# EAGLE board A20-OLinuXino-Lime-4GB_Rev_D (EAGLE 4.16), part 1 of 5
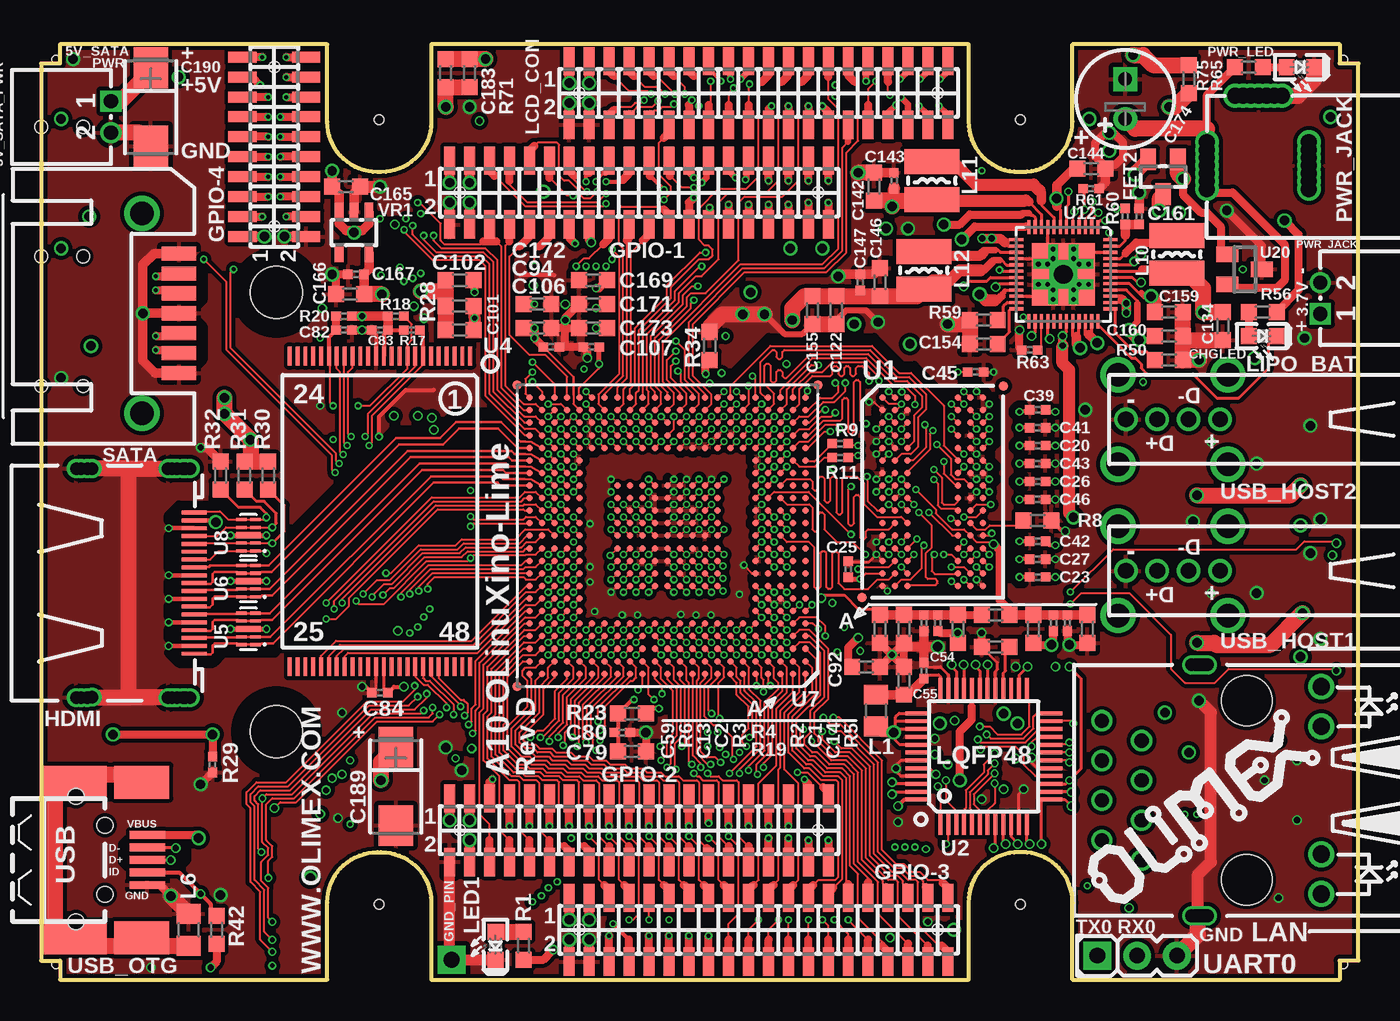
[diagram p5: board, top side]
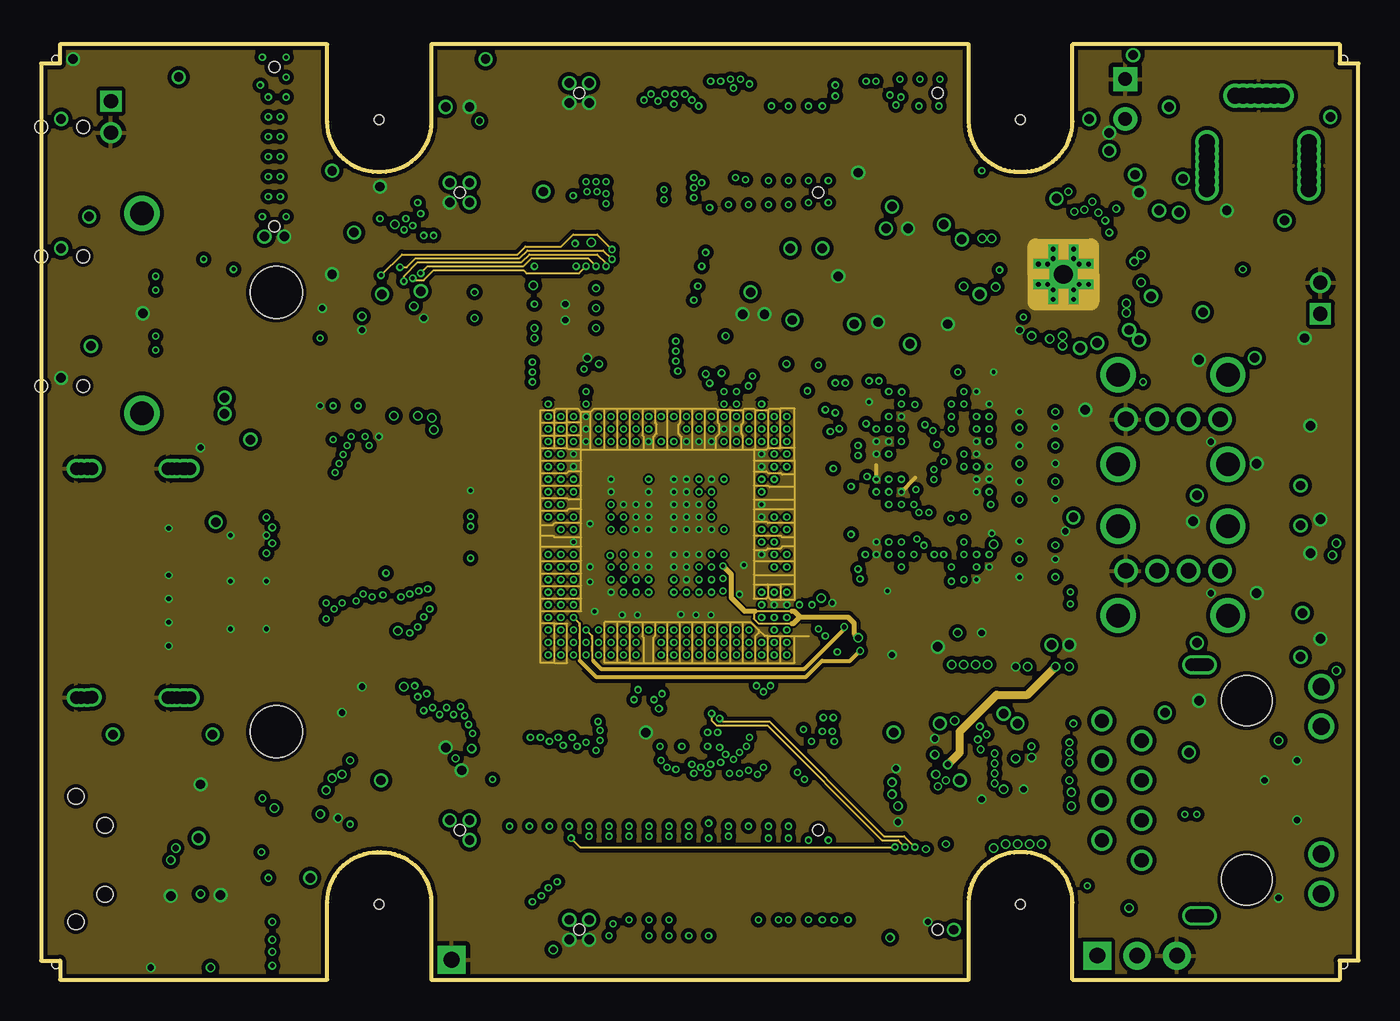
[diagram p6: board, inner layer Route2]
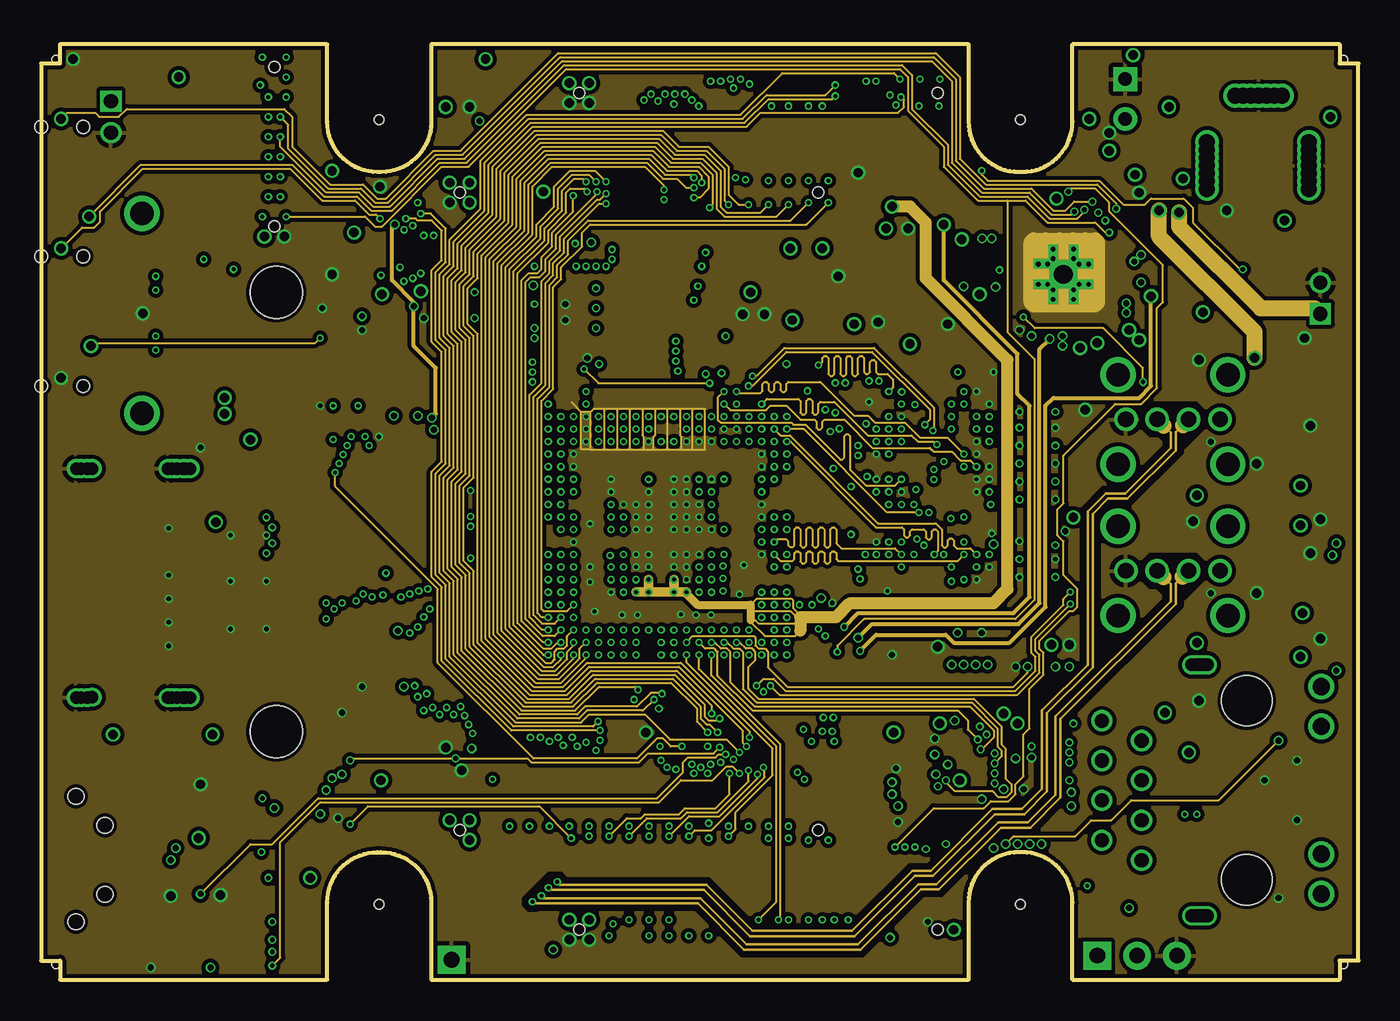
[diagram p7: board, inner layer Route3]
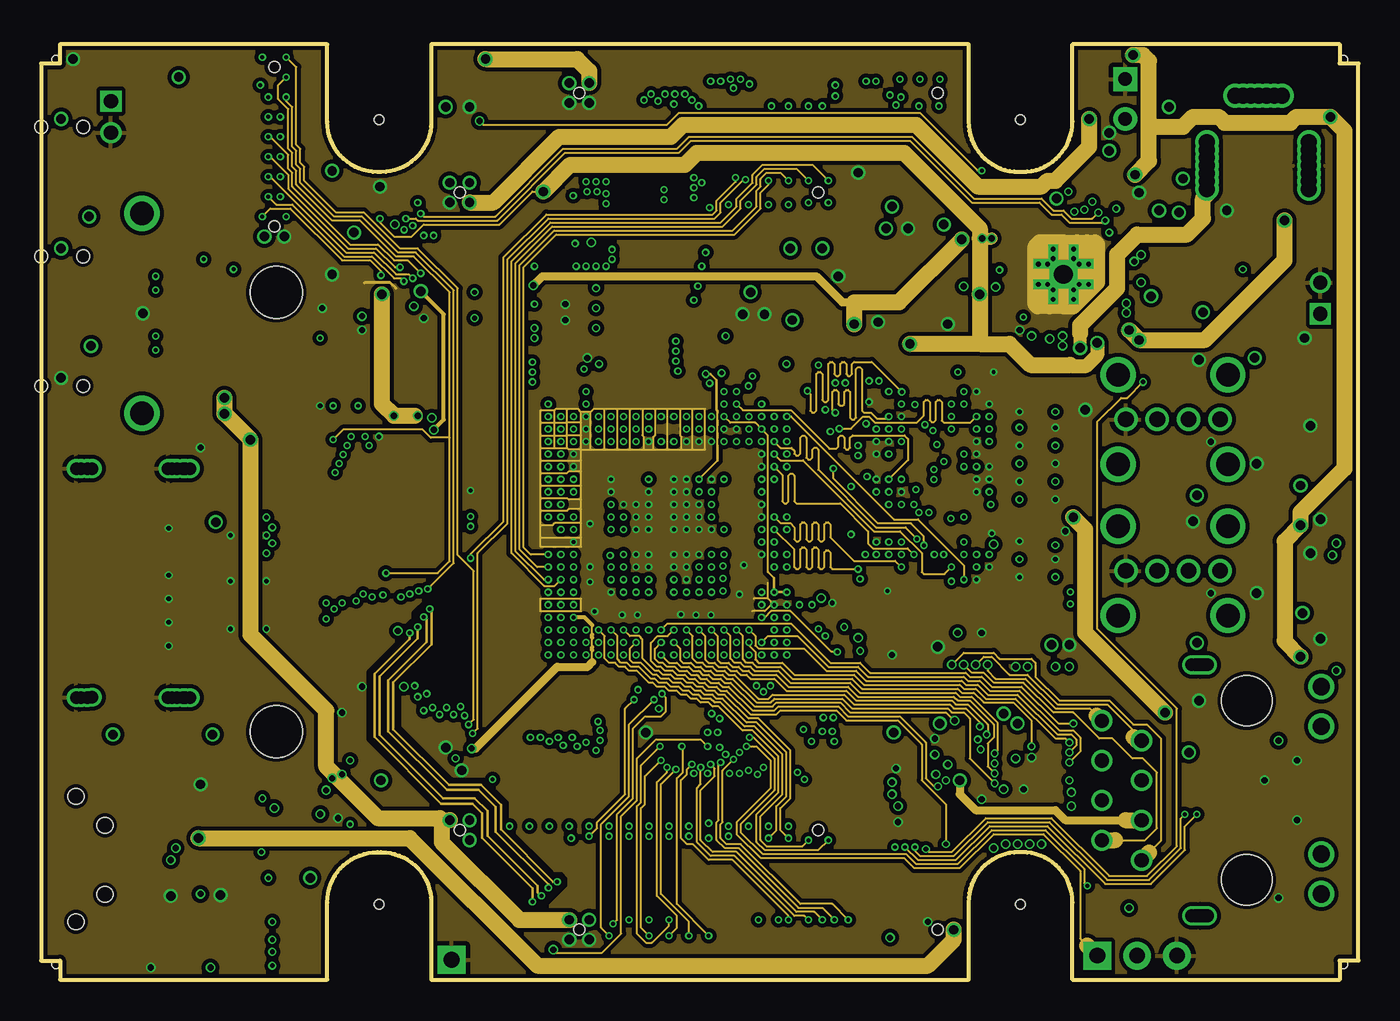
[diagram p8: board, inner layer Route14]
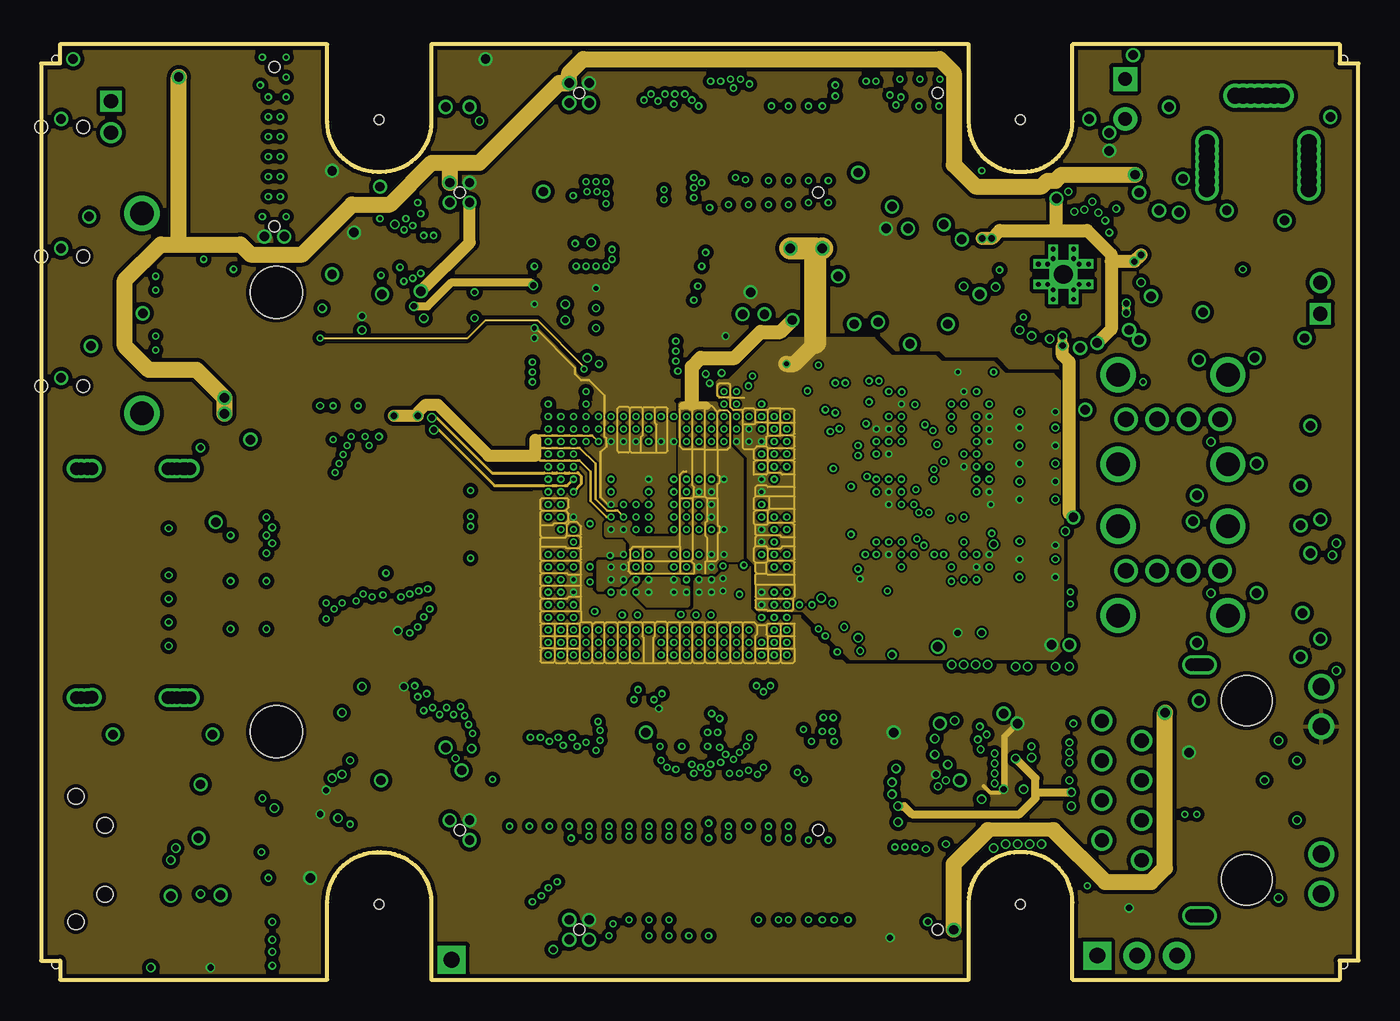
[diagram p9: board, inner layer Route15]
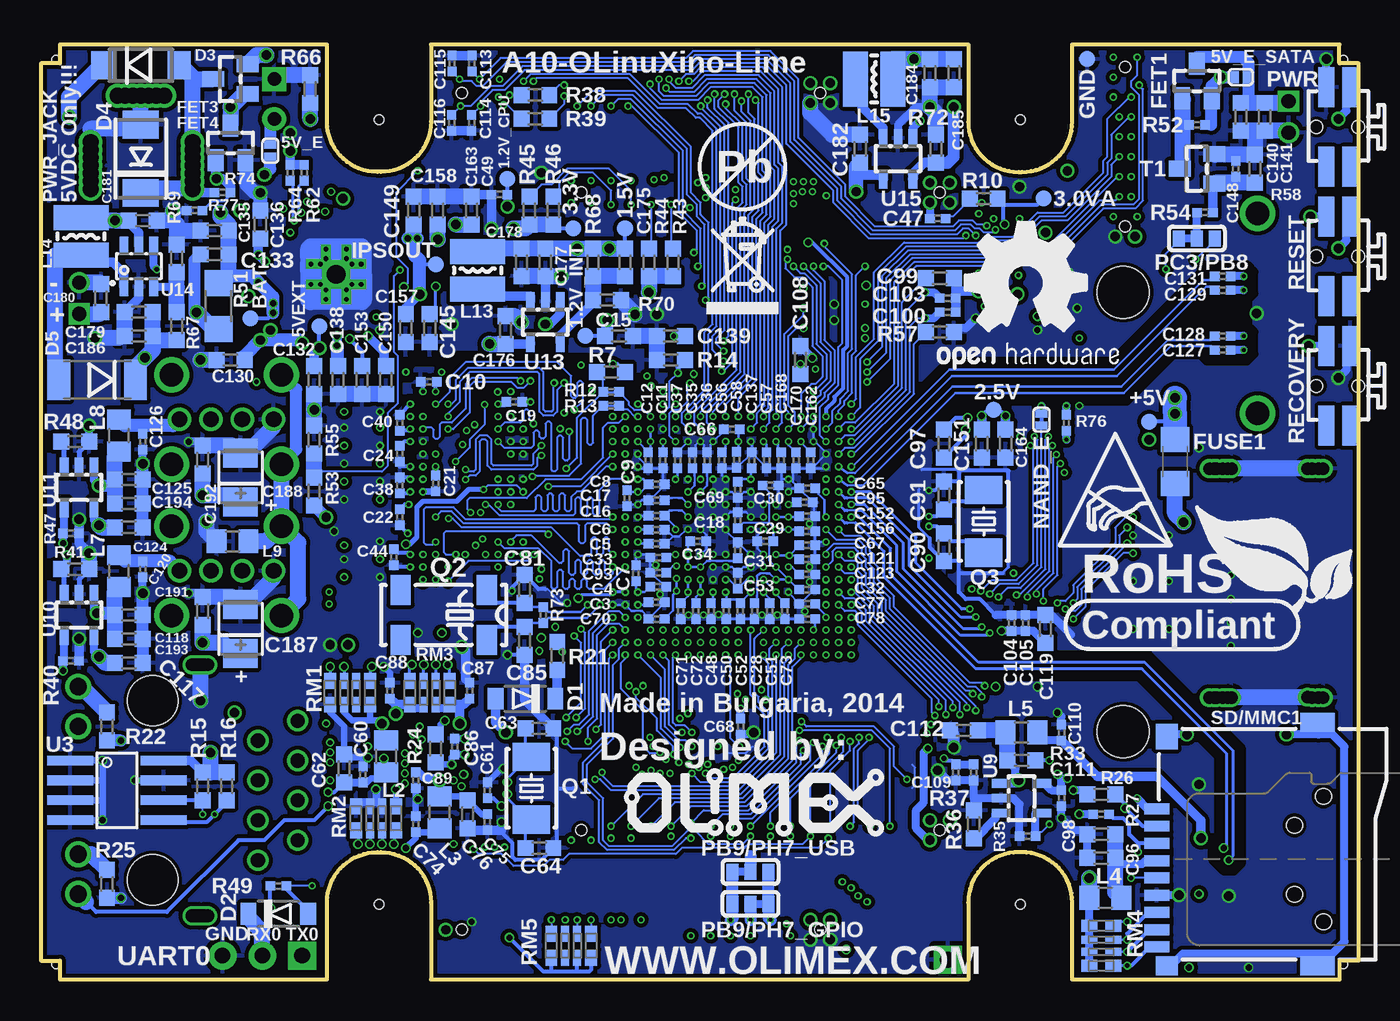
[diagram p10: board, bottom side, seen from below]

Size 83.96 x 59.61 mm. Coordinates in mm from the lower left corner, seen from the top.
Copper layers (1*2*3*14*15*16): Top 0.035mm / dielectric 5mil / Route2 0.035mm / dielectric 0.5mm / Route3 0.035mm / dielectric 0.2mm / Route14 0.035mm / dielectric 0.5mm / Route15 0.035mm / dielectric 5mil / Bottom 0.035mm
Design rules "default": minimum track width 4.5mil, minimum drill 10mil, track to track 5mil, track to pad 5mil, pad to pad 5mil, via to via 5mil, smd to smd 1mil, copper to edge 10mil, drill to drill 8mil, minimum pad ring 6mil, minimum via ring 4mil, stop-mask expansion 4mil, vias tented up to drill 25mil, thermal gap 12mil
tRestrict: 187 lines
bRestrict: 115 lines

## Footprints (pad centres in the part's own frame; a part is rotated, then mirrored left to right if it is on the bottom)
TESTPAD_40-ROUND = smd 1.016 x 1.016: 1 0,0
SJ_1_SMALLER = smd 0.508 x 0.762: 1 -0.381,0; 2 0.381,0
DW02R = drill 0.9 square: 1 -1,0 | drill 0.9: 2 1,0
C0402_TI = smd 0.61 x 0.584: 1 -0.508,0; 2 0.508,0
C0603_DWS = smd 1.016 x 1.016: 1 -0.889,0; 2 0.889,0
E2,5-6,3 = drill 0.864 pad 1.524: + -1.27,0 | drill 0.864 pad 1.524 square: - 1.27,0
CT3528_MIL = smd 1.854 x 2.184: + 1.562,0; - -1.562,0
CT6032 = smd 2.6 x 2.2: + 2.5,0; - -2.5,0
LED-0603 = smd 1.016 x 1.016: A 0.889,0; C -0.889,0
SOD-123 = smd 1 x 1.4: A 1.9,0; C -1.9,0
MLL-41 = smd 1.45 x 1.8: A 2.445,0; K -2.445,0
DO214AA = smd 1.778 x 2.286: A 2.177,0; C -2.177,0
MELF-MLL41 = smd 1.45 x 2.6: 1 -2.445,0; 2 2.445,0
SOT23 = smd 1.4 x 1: 1 1.1,-0.95; 2 1.1,0.95; 3 -1.1,0
1206 = smd 1.6 x 1.8: 1 -1.4,0; 2 1.4,0
TEST_PAD40/70/SQUARE = drill 1.016 pad 1.778 square: P$1 0,0
YA-V36P-2X20-LF = smd 0.7 x 1.8: 1 -12.065,2.032; 2 -12.065,-2.032; 3 -10.795,2.032; 4 -10.795,-2.032; 5 -9.525,2.032; 6 -9.525,-2.032; 7 -8.255,2.032; 8 -8.255,-2.032; 9 -6.985,2.032; 10 -6.985,-2.032; 11 -5.715,2.032; 12 -5.715,-2.032; 13 -4.445,2.032; 14 -4.445,-2.032; 15 -3.175,2.032; 16 -3.175,-2.032; 17 -1.905,2.032; 18 -1.905,-2.032; 19 -0.635,2.032; 20 -0.635,-2.032; 21 0.635,2.032; 22 0.635,-2.032; 23 1.905,2.032; 24 1.905,-2.032; 25 3.175,2.032; 26 3.175,-2.032; 27 4.445,2.032; 28 4.445,-2.032; 29 5.715,2.032; 30 5.715,-2.032; 31 6.985,2.032; 32 6.985,-2.032; 33 8.255,2.032; 34 8.255,-2.032; 35 9.525,2.032; 36 9.525,-2.032; 37 10.795,2.032; 38 10.795,-2.032; 39 12.065,2.032; 40 12.065,-2.032 | hole 0.7: -11.43,0; 11.43,0
YA-V36P-2X10-LF = smd 0.7 x 1.8: 1 -5.715,2.032; 2 -5.715,-2.032; 3 -4.445,2.032; 4 -4.445,-2.032; 5 -3.175,2.032; 6 -3.175,-2.032; 7 -1.905,2.032; 8 -1.905,-2.032; 9 -0.635,2.032; 10 -0.635,-2.032; 11 0.635,2.032; 12 0.635,-2.032; 13 1.905,2.032; 14 1.905,-2.032; 15 3.175,2.032; 16 3.175,-2.032; 17 4.445,2.032; 18 4.445,-2.032; 19 5.715,2.032; 20 5.715,-2.032 | hole 0.7: -5.08,0; 5.08,0
HDMI-SWM-19_REV_B = smd 0.25 x 1.6: 1 -4.5,-5.55; 2 -4,-5.55; 3 -3.5,-5.55; 4 -3,-5.55; 5 -2.5,-5.55; 6 -2,-5.55; 7 -1.5,-5.55; 8 -1,-5.55; 9 -0.5,-5.55; 10 0,-5.55; 11 0.5,-5.55; 12 1,-5.55; 13 1.5,-5.55; 14 2,-5.55; 15 2.5,-5.55; 16 3,-5.55; 17 3.5,-5.55; 18 4,-5.55; 19 4.5,-5.55 | drill 0.8: P$5 -7.3,-4.85; P$7 -7.3,1.25; P$9 7.3,1.25; P$11 7.3,-4.85; P$13 -7.3,-4.45; P$15 -7.3,1.65; P$18 7.3,1.65; P$20 7.3,-4.45; P$21 -7.3,-4.15; P$22 -7.3,-5; P$23 7.3,-5; P$24 7.3,-4.15; P$25 -7.3,-5.3; P$26 7.3,-5.3; P$27 7.3,0.95; P$28 -7.275,0.95; SH1 -7.3,-3.9; SH2 -7.3,1.95; SH3 7.3,1.95; SH4 7.3,-3.9
L0805_5MIL_DWS = smd 1.27 x 1.524: 1 -1.016,0; 2 1.016,0
CD32 = smd 1.6 x 3.5: 1 -1.2,0; 2 1.2,0
RJLBC-060TC1_MILLING = drill 0.9: 1 -4.455,6.7; 2 -3.185,9.24; 3 -1.915,6.7; 4 -0.645,9.24; 5 0.625,6.7; 6 1.895,9.24; 7 3.165,6.7; 8 4.435,9.24 | drill 0.8: _1 -8,2.5; _2 -8,2.7; _3 -8,2.9; _4 -8,3.3; _5 -8,3.5; _6 8,3.5; _7 8,3.3; _8 8,2.9; _9 8,2.7; _10 8,2.5; GND1 -8,3.1; GND2 8,3.1 | drill 1.1: AG 4.07,-4.748; AY -6.61,-4.748; KG 6.61,-4.748; KY -4.07,-4.748 | hole 3.2: -5.715,0; 5.715,0
SJ_1_SMALLER_CLOSE_10MILS = smd 0.508 x 0.762: 1 -0.381,0; 2 0.381,0
SJ_2_SMALL_23_TIED = smd 0.762 x 1.016: 1 -1.143,0; 2 0,0; 3 1.143,0
SW_TAKT3X4 = smd 2.54 x 1.016: 1_1 -2.54,0.762; 1_2 2.54,0.762; 2_1 -2.54,-0.762; 2_2 2.54,-0.762 | hole 0.8: 0,-1.397; 0,1.27
PWR_JACK_UNI_MILLING = drill 1: + 0,4.75; +1 0,5.25; +2 0,5.75; +3 0,6.25; +4 0,4.25; +5 0,3.75; +6 0,3.25; - -6.5,4.75; -1 -6.5,5.25; -2 -6.5,5.75; -3 -6.5,4.25; -4 -6.5,3.75; -5 -6.5,6.25; -6 -6.5,3.25; -- -3.3,0.3; --1 -3.8,0.3; --2 -4.3,0.3; --3 -4.8,0.3; --4 -2.8,0.3; --5 -2.3,0.3; --6 -1.8,0.3
HCX-4S = smd 1.8 x 2.4: 1 -2,0; 2 2,0
MC-306 = smd 1.3 x 1.9: 1 -2.75,-1.6; 2 2.75,-1.6; 3 2.75,1.6; 4 -2.75,1.6
R0603_5MIL_DWS = smd 1.016 x 1.016: 1 -0.889,0; 2 0.889,0
R0402_TI = smd 0.61 x 0.584: 1 -0.508,0; 2 0.508,0
R0402_TI_0R = smd 0.61 x 0.584: 1 -0.508,0; 2 0.508,0
R1206_5MIL_WS = smd 1.651 x 1.778: 1 -1.46,0; 2 1.46,0
0603_0R = smd 1.016 x 1.016: 1 -0.889,0; 2 0.889,0
R_MATRIX_4 = smd 0.762 x 1.016: 1.1 -1.27,-0.762; 1.2 -1.27,0.762; 4.1 1.27,-0.762; 4.2 1.27,0.762 | smd 0.508 x 1.016: 2.1 -0.381,-0.762; 2.2 -0.381,0.762; 3.1 0.381,-0.762; 3.2 0.381,0.762
SATA-PWA-07 = smd 0.9 x 2.2: 1 -4.25,-4.8; 2 -2.98,-4.8; 3 -1.71,-4.8; 4 -0.44,-4.8; 5 0.83,-4.8; 6 2.1,-4.8; 7 3.37,-4.8 | drill 1.5: P$8 -6.81,-2.44; P$9 5.93,-2.44
TFC-WPAPR-08 = smd 1.6 x 0.7: 1 -7.375,2.25; 2 -7.375,1.15; 3 -7.375,0.05; 4 -7.375,-1.05; 5 -7.375,-2.15; 6 -7.375,-3.25; 7 -7.375,-4.35; 8 -7.375,-5.45; 9 -7.375,-6.55 | smd 1.4 x 1.2: 10 -6.75,-7.75 | smd 1.4 x 1.6: 11 -6.75,6.85 | smd 2.2 x 1.2: 12 2.85,-7.75; 13 2.85,7.75 | hole 1: 3.25,-4.95; 3.25,3.05
FBGA96_MEM = smd 0.4 x 0.4: A1 -6,-3.2; A2 -6,-2.4; A3 -6,-1.6; A7 -6,1.6; A8 -6,2.4; A9 -6,3.2; B1 -5.2,-3.2; B2 -5.2,-2.4; B3 -5.2,-1.6; B7 -5.2,1.6; B8 -5.2,2.4; B9 -5.2,3.2; C1 -4.4,-3.2; C2 -4.4,-2.4; C3 -4.4,-1.6; C7 -4.4,1.6; C8 -4.4,2.4; C9 -4.4,3.2; D1 -3.6,-3.2; D2 -3.6,-2.4; D3 -3.6,-1.6; D7 -3.6,1.6; D8 -3.6,2.4; D9 -3.6,3.2; E1 -2.8,-3.2; E2 -2.8,-2.4; E3 -2.8,-1.6; E7 -2.8,1.6; E8 -2.8,2.4; E9 -2.8,3.2; F1 -2,-3.2; F2 -2,-2.4; F3 -2,-1.6; F7 -2,1.6; F8 -2,2.4; F9 -2,3.2; G1 -1.2,-3.2; G2 -1.2,-2.4; G3 -1.2,-1.6; G7 -1.2,1.6; G8 -1.2,2.4; G9 -1.2,3.2; H1 -0.4,-3.2; H2 -0.4,-2.4; H3 -0.4,-1.6; H7 -0.4,1.6; H8 -0.4,2.4; H9 -0.4,3.2; J1 0.4,-3.2; J2 0.4,-2.4; J3 0.4,-1.6; J7 0.4,1.6; J8 0.4,2.4; J9 0.4,3.2; K1 1.2,-3.2; K2 1.2,-2.4; K3 1.2,-1.6; K7 1.2,1.6; K8 1.2,2.4; K9 1.2,3.2; L1 2,-3.2; L2 2,-2.4; L3 2,-1.6; L7 2,1.6; L8 2,2.4; L9 2,3.2; M1 2.8,-3.2; M2 2.8,-2.4; M3 2.8,-1.6; M7 2.8,1.6; M8 2.8,2.4; M9 2.8,3.2; N1 3.6,-3.2; N2 3.6,-2.4; N3 3.6,-1.6; N7 3.6,1.6; N8 3.6,2.4; N9 3.6,3.2; P1 4.4,-3.2; P2 4.4,-2.4; P3 4.4,-1.6; P7 4.4,1.6; P8 4.4,2.4; P9 4.4,3.2; R1 5.2,-3.2; R2 5.2,-2.4; R3 5.2,-1.6; R7 5.2,1.6; R8 5.2,2.4; R9 5.2,3.2; T1 6,-3.2; T2 6,-2.4; T3 6,-1.6; T7 6,1.6; T8 6,2.4; T9 6,3.2 | smd 0.6 x 0.6: FID1 6.75,-4.5; FID2 -6.75,4.5
LQFP48 = smd 0.254 x 1.4: 1 -2.75,-4.3; 2 -2.25,-4.3; 3 -1.75,-4.3; 4 -1.25,-4.3; 5 -0.75,-4.3; 6 -0.25,-4.3; 7 0.25,-4.3; 8 0.75,-4.3; 9 1.25,-4.3; 10 1.75,-4.3; 11 2.25,-4.3; 12 2.75,-4.3; 25 2.75,4.3; 26 2.25,4.3; 27 1.75,4.3; 28 1.25,4.3; 29 0.75,4.3; 30 0.25,4.3; 31 -0.25,4.3; 32 -0.75,4.3; 33 -1.25,4.3; 34 -1.75,4.3; 35 -2.25,4.3; 36 -2.75,4.3 | smd 1.4 x 0.254: 13 4.3,-2.75; 14 4.3,-2.25; 15 4.3,-1.75; 16 4.3,-1.25; 17 4.3,-0.75; 18 4.3,-0.25; 19 4.3,0.25; 20 4.3,0.75; 21 4.3,1.25; 22 4.3,1.75; 23 4.3,2.25; 24 4.3,2.75; 37 -4.3,2.75; 38 -4.3,2.25; 39 -4.3,1.75; 40 -4.3,1.25; 41 -4.3,0.75; 42 -4.3,0.25; 43 -4.3,-0.25; 44 -4.3,-0.75; 45 -4.3,-1.25; 46 -4.3,-1.75; 47 -4.3,-2.25; 48 -4.3,-2.75
SO-08MN = smd 0.61 x 2.921: 1 -1.905,-2.981; 2 -0.635,-2.981; 3 0.635,-2.981; 4 1.905,-2.981; 5 1.905,2.981; 6 0.635,2.981; 7 -0.635,2.981; 8 -1.905,2.981
TSOP48 = smd 1.2 x 0.25: 1 -9.9,5.75; 2 -9.9,5.25; 3 -9.9,4.75; 4 -9.9,4.25; 5 -9.9,3.75; 6 -9.9,3.25; 7 -9.9,2.75; 8 -9.9,2.25; 9 -9.9,1.75; 10 -9.9,1.25; 11 -9.9,0.75; 12 -9.9,0.25; 13 -9.9,-0.25; 14 -9.9,-0.75; 15 -9.9,-1.25; 16 -9.9,-1.75; 17 -9.9,-2.25; 18 -9.9,-2.75; 19 -9.9,-3.25; 20 -9.9,-3.75; 21 -9.9,-4.25; 22 -9.9,-4.75; 23 -9.9,-5.25; 24 -9.9,-5.75; 25 9.9,-5.75; 26 9.9,-5.25; 27 9.9,-4.75; 28 9.9,-4.25; 29 9.9,-3.75; 30 9.9,-3.25; 31 9.9,-2.75; 32 9.9,-2.25; 33 9.9,-1.75; 34 9.9,-1.25; 35 9.9,-0.75; 36 9.9,-0.25; 37 9.9,0.25; 38 9.9,0.75; 39 9.9,1.25; 40 9.9,1.75; 41 9.9,2.25; 42 9.9,2.75; 43 9.9,3.25; 44 9.9,3.75; 45 9.9,4.25; 46 9.9,4.75; 47 9.9,5.25; 48 9.9,5.75
SLP2510P8 = smd 0.2 x 0.675: 1 -1,-0.438; 2 -0.5,-0.438; 4 0.5,-0.438; 5 1,-0.438; 6 1,0.438; 7 0.5,0.438; 9 -0.5,0.438; 10 -1,0.438 | smd 0.4 x 0.775: 3 0,-0.388; 8 0,0.388
TFBGA441 = smd 0.4 x 0.4: A1 -8.8,-8.8; A2 -8.8,-8; A3 -8.8,-7.2; A4 -8.8,-6.4; A5 -8.8,-5.6; A6 -8.8,-4.8; A7 -8.8,-4; A8 -8.8,-3.2; A9 -8.8,-2.4; A10 -8.8,-1.6; A11 -8.8,-0.8; A12 -8.8,0; A13 -8.8,0.8; A14 -8.8,1.6; A15 -8.8,2.4; A16 -8.8,3.2; A17 -8.8,4; A18 -8.8,4.8; A19 -8.8,5.6; A20 -8.8,6.4; A21 -8.8,7.2; A22 -8.8,8; A23 -8.8,8.8; AA1 7.2,-8.8; AA2 7.2,-8; AA3 7.2,-7.2; AA4 7.2,-6.4; AA5 7.2,-5.6; AA6 7.2,-4.8; AA7 7.2,-4; AA8 7.2,-3.2; AA9 7.2,-2.4; AA10 7.2,-1.6; AA11 7.2,-0.8; AA12 7.2,0; AA13 7.2,0.8; AA14 7.2,1.6; AA15 7.2,2.4; AA16 7.2,3.2; AA17 7.2,4; AA18 7.2,4.8; AA19 7.2,5.6; AA20 7.2,6.4; AA21 7.2,7.2; AA22 7.2,8; AA23 7.2,8.8; AB1 8,-8.8; AB2 8,-8; AB3 8,-7.2; AB4 8,-6.4; AB5 8,-5.6; AB6 8,-4.8; AB7 8,-4; AB8 8,-3.2; AB9 8,-2.4; AB10 8,-1.6; AB11 8,-0.8; AB12 8,0; AB13 8,0.8; AB14 8,1.6; AB15 8,2.4; AB16 8,3.2; AB17 8,4; AB18 8,4.8; AB19 8,5.6; AB20 8,6.4; AB21 8,7.2; AB22 8,8; AB23 8,8.8; AC1 8.8,-8.8; AC2 8.8,-8; AC3 8.8,-7.2; AC4 8.8,-6.4; AC5 8.8,-5.6; AC6 8.8,-4.8; AC7 8.8,-4; AC8 8.8,-3.2; AC9 8.8,-2.4; AC10 8.8,-1.6; AC11 8.8,-0.8; AC12 8.8,0; AC13 8.8,0.8; AC14 8.8,1.6; AC15 8.8,2.4; AC16 8.8,3.2; AC17 8.8,4; AC18 8.8,4.8; AC19 8.8,5.6; AC20 8.8,6.4; AC21 8.8,7.2; AC22 8.8,8; AC23 8.8,8.8; B1 -8,-8.8; B2 -8,-8; B3 -8,-7.2; B4 -8,-6.4; B5 -8,-5.6; B6 -8,-4.8; B7 -8,-4; B8 -8,-3.2; B9 -8,-2.4; B10 -8,-1.6; B11 -8,-0.8; B12 -8,0; B13 -8,0.8; B14 -8,1.6; B15 -8,2.4; B16 -8,3.2; B17 -8,4; B18 -8,4.8; B19 -8,5.6; B20 -8,6.4; B21 -8,7.2; B22 -8,8; B23 -8,8.8; C1 -7.2,-8.8; C2 -7.2,-8; C3 -7.2,-7.2; C4 -7.2,-6.4; C5 -7.2,-5.6; C6 -7.2,-4.8; C7 -7.2,-4; C8 -7.2,-3.2; C9 -7.2,-2.4; C10 -7.2,-1.6; C11 -7.2,-0.8; C12 -7.2,0; C13 -7.2,0.8; C14 -7.2,1.6; C15 -7.2,2.4; C16 -7.2,3.2; C17 -7.2,4; C18 -7.2,4.8; C19 -7.2,5.6; C20 -7.2,6.4; C21 -7.2,7.2; C22 -7.2,8; C23 -7.2,8.8; D1 -6.4,-8.8; D2 -6.4,-8; D3 -6.4,-7.2; D4 -6.4,-6.4; D5 -6.4,-5.6; D6 -6.4,-4.8; D7 -6.4,-4; D8 -6.4,-3.2; D9 -6.4,-2.4; D10 -6.4,-1.6; D11 -6.4,-0.8; D12 -6.4,0; D13 -6.4,0.8; D14 -6.4,1.6; D15 -6.4,2.4; D16 -6.4,3.2; D17 -6.4,4; D18 -6.4,4.8; D19 -6.4,5.6; D20 -6.4,6.4; D21 -6.4,7.2; D22 -6.4,8; D23 -6.4,8.8; E1 -5.6,-8.8; E2 -5.6,-8; E3 -5.6,-7.2; E4 -5.6,-6.4; E5 -5.6,-5.6; E6 -5.6,-4.8; E7 -5.6,-4; E8 -5.6,-3.2; E9 -5.6,-2.4; E10 -5.6,-1.6; E11 -5.6,-0.8; E12 -5.6,0; E13 -5.6,0.8; E14 -5.6,1.6; E15 -5.6,2.4; E16 -5.6,3.2; E17 -5.6,4; E18 -5.6,4.8; E19 -5.6,5.6; E20 -5.6,6.4; E21 -5.6,7.2; E22 -5.6,8; E23 -5.6,8.8; F1 -4.8,-8.8; F2 -4.8,-8; F3 -4.8,-7.2; F4 -4.8,-6.4; F5 -4.8,-5.6; F19 -4.8,5.6; F20 -4.8,6.4; F21 -4.8,7.2; F22 -4.8,8; F23 -4.8,8.8; G1 -4,-8.8; G2 -4,-8; G3 -4,-7.2; G4 -4,-6.4; G5 -4,-5.6; G19 -4,5.6; G20 -4,6.4; G21 -4,7.2; G22 -4,8; G23 -4,8.8; H1 -3.2,-8.8; H2 -3.2,-8; H3 -3.2,-7.2; H4 -3.2,-6.4; H5 -3.2,-5.6; H8 -3.2,-3.2; H9 -3.2,-2.4; H10 -3.2,-1.6; H11 -3.2,-0.8; H12 -3.2,0; H13 -3.2,0.8; H14 -3.2,1.6; H15 -3.2,2.4; H16 -3.2,3.2; H19 -3.2,5.6; H20 -3.2,6.4; H21 -3.2,7.2; H22 -3.2,8; H23 -3.2,8.8; J1 -2.4,-8.8; J2 -2.4,-8; J3 -2.4,-7.2; J4 -2.4,-6.4; J5 -2.4,-5.6; J8 -2.4,-3.2; J9 -2.4,-2.4; J10 -2.4,-1.6; J11 -2.4,-0.8; J12 -2.4,0; J13 -2.4,0.8; J14 -2.4,1.6; J15 -2.4,2.4; J16 -2.4,3.2; J19 -2.4,5.6; J20 -2.4,6.4; J21 -2.4,7.2; J22 -2.4,8; J23 -2.4,8.8; K1 -1.6,-8.8; K2 -1.6,-8; K3 -1.6,-7.2; K4 -1.6,-6.4; K5 -1.6,-5.6; K8 -1.6,-3.2; K9 -1.6,-2.4; K10 -1.6,-1.6; K11 -1.6,-0.8; K12 -1.6,0; K13 -1.6,0.8; K14 -1.6,1.6; K15 -1.6,2.4; K16 -1.6,3.2; K19 -1.6,5.6; K20 -1.6,6.4; K21 -1.6,7.2; K22 -1.6,8; K23 -1.6,8.8; L1 -0.8,-8.8; L2 -0.8,-8; L3 -0.8,-7.2; L4 -0.8,-6.4; L5 -0.8,-5.6; L8 -0.8,-3.2; L9 -0.8,-2.4; L10 -0.8,-1.6; L11 -0.8,-0.8; L12 -0.8,0; L13 -0.8,0.8; L14 -0.8,1.6; L15 -0.8,2.4; L16 -0.8,3.2; L19 -0.8,5.6; L20 -0.8,6.4; L21 -0.8,7.2; L22 -0.8,8; L23 -0.8,8.8; M1 0,-8.8; M2 0,-8; M3 0,-7.2; M4 0,-6.4; M5 0,-5.6; M8 0,-3.2; M9 0,-2.4; M10 0,-1.6; M11 0,-0.8; M12 0,0; M13 0,0.8; M14 0,1.6; M15 0,2.4; M16 0,3.2; M19 0,5.6; M20 0,6.4; M21 0,7.2; M22 0,8; M23 0,8.8; N1 0.8,-8.8; N2 0.8,-8; N3 0.8,-7.2; N4 0.8,-6.4; N5 0.8,-5.6; N8 0.8,-3.2; N9 0.8,-2.4; N10 0.8,-1.6; N11 0.8,-0.8; N12 0.8,0; N13 0.8,0.8; N14 0.8,1.6; N15 0.8,2.4; N16 0.8,3.2; N19 0.8,5.6; N20 0.8,6.4; N21 0.8,7.2; N22 0.8,8; N23 0.8,8.8; P1 1.6,-8.8; P2 1.6,-8; P3 1.6,-7.2; P4 1.6,-6.4; P5 1.6,-5.6; P8 1.6,-3.2; P9 1.6,-2.4; P10 1.6,-1.6; P11 1.6,-0.8; P12 1.6,0; P13 1.6,0.8; P14 1.6,1.6; P15 1.6,2.4; P16 1.6,3.2; P19 1.6,5.6; P20 1.6,6.4; P21 1.6,7.2; P22 1.6,8; P23 1.6,8.8; R1 2.4,-8.8; R2 2.4,-8; R3 2.4,-7.2; R4 2.4,-6.4; R5 2.4,-5.6; R8 2.4,-3.2; R9 2.4,-2.4; R10 2.4,-1.6; R11 2.4,-0.8; R12 2.4,0; R13 2.4,0.8; R14 2.4,1.6; R15 2.4,2.4; R16 2.4,3.2; R19 2.4,5.6; R20 2.4,6.4; R21 2.4,7.2; R22 2.4,8; R23 2.4,8.8; T1 3.2,-8.8; T2 3.2,-8; T3 3.2,-7.2; T4 3.2,-6.4; T5 3.2,-5.6; T8 3.2,-3.2; T9 3.2,-2.4; T10 3.2,-1.6; T11 3.2,-0.8; T12 3.2,0; T13 3.2,0.8; T14 3.2,1.6; T15 3.2,2.4; T16 3.2,3.2; T19 3.2,5.6; T20 3.2,6.4; T21 3.2,7.2; T22 3.2,8; T23 3.2,8.8; U1 4,-8.8; U2 4,-8; U3 4,-7.2; U4 4,-6.4; U5 4,-5.6; U19 4,5.6; U20 4,6.4; U21 4,7.2; U22 4,8; U23 4,8.8; V1 4.8,-8.8; V2 4.8,-8; V3 4.8,-7.2; V4 4.8,-6.4; V5 4.8,-5.6; V19 4.8,5.6; V20 4.8,6.4; V21 4.8,7.2; V22 4.8,8; V23 4.8,8.8; W1 5.6,-8.8; W2 5.6,-8; W3 5.6,-7.2; W4 5.6,-6.4; W5 5.6,-5.6; W6 5.6,-4.8; W7 5.6,-4; W8 5.6,-3.2; W9 5.6,-2.4; W10 5.6,-1.6; W11 5.6,-0.8; W12 5.6,0; W13 5.6,0.8; W14 5.6,1.6; W15 5.6,2.4; W16 5.6,3.2; W17 5.6,4; W18 5.6,4.8; W19 5.6,5.6; W20 5.6,6.4; W21 5.6,7.2; W22 5.6,8; W23 5.6,8.8; Y1 6.4,-8.8; Y2 6.4,-8; Y3 6.4,-7.2; Y4 6.4,-6.4; Y5 6.4,-5.6; Y6 6.4,-4.8; Y7 6.4,-4; Y8 6.4,-3.2; Y9 6.4,-2.4; Y10 6.4,-1.6; Y11 6.4,-0.8; Y12 6.4,0; Y13 6.4,0.8; Y14 6.4,1.6; Y15 6.4,2.4; Y16 6.4,3.2; Y17 6.4,4; Y18 6.4,4.8; Y19 6.4,5.6; Y20 6.4,6.4; Y21 6.4,7.2; Y22 6.4,8; Y23 6.4,8.8 | smd 0.6 x 0.6: FID1 -9.6,9.6; FID2 9.6,9.6; FID3 9.6,-9.6
SOT23-5 = smd 1.2 x 0.55: 1 1.3,-0.95; 2 1.3,0; 3 1.3,0.95; 4 -1.3,0.95; 5 -1.3,-0.95
QFN48 = smd 0.2 x 0.9: 1 -2.2,-3; 2 -1.8,-3; 3 -1.4,-3; 4 -1,-3; 5 -0.6,-3; 6 -0.2,-3; 7 0.2,-3; 8 0.6,-3; 9 1,-3; 10 1.4,-3; 11 1.8,-3; 12 2.2,-3; 25 2.2,3; 26 1.8,3; 27 1.4,3; 28 1,3; 29 0.6,3; 30 0.2,3; 31 -0.2,3; 32 -0.6,3; 33 -1,3; 34 -1.4,3; 35 -1.8,3; 36 -2.2,3 | smd 0.9 x 0.2: 13 3,-2.2; 14 3,-1.8; 15 3,-1.4; 16 3,-1; 17 3,-0.6; 18 3,-0.2; 19 3,0.2; 20 3,0.6; 21 3,1; 22 3,1.4; 23 3,1.8; 24 3,2.2; 37 -3,2.2; 38 -3,1.8; 39 -3,1.4; 40 -3,1; 41 -3,0.6; 42 -3,0.2; 43 -3,-0.2; 44 -3,-0.6; 45 -3,-1; 46 -3,-1.4; 47 -3,-1.8; 48 -3,-2.2 | drill 1.2 pad 1.422 square: N1 0,0 | drill 0.3 pad 0.4 square: N2 -1.6,0.65; N3 -1,0.65; N4 -1.6,-0.65; N5 -1,-0.65; N6 -0.65,-1.6; N7 -0.65,-1; N8 0.65,-1.6; N9 0.65,-1; N10 1.6,-0.65; N11 1,-0.65; N12 1.6,0.65; N13 1,0.65; N14 0.65,1.6; N15 0.65,1; N16 -0.65,1.6; N17 -0.65,1 | smd 4 x 4: VSS 0,0
SOT23-6 = smd 1.2 x 0.55: 1 1.3,-0.95; 2 1.3,0; 3 1.3,0.95; 4 -1.3,0.95; 5 -1.3,0; 6 -1.3,-0.95
SOT23' = smd 1 x 1.4: 1 -0.95,-1.1; 2 0.95,-1.1; 3 0,1.1
HAMMOND_1593LBK_A10_LIME = hole 3.3: 14.98,15.81; 14.98,43.81 | hole 0.6: 21.55,4.81; 21.55,54.81; 62.41,4.81; 62.41,54.81 | hole 0.5: 0.95,58.66; 83.01,58.66; 83.01,0.95; 0.95,0.95
HN1X3 = drill 1 pad 1.778 square: 1 -2.54,0 | drill 1 pad 1.778: 2 0,0; 3 2.54,0
USB_A_VERTICAL_PTH = drill 1: 1 3.45,12.75; 2 3.45,14.75; 3 3.45,16.75; 4 3.45,18.75 | drill 1.5: P$1 0.6,12.25; P$2 6.3,12.25; P$3 6.3,19.25; P$4 0.6,19.25
USB_MINI_9PIN = smd 2.25 x 0.5: D+ 2.706,0; D- 2.706,0.8; GND 2.706,-1.6; ID 2.706,-0.8; VBUS 2.706,1.6 | smd 4 x 2.1: GND1 -1.9,4.95; GND3 -1.9,-4.95 | smd 3.5 x 2.1: GND2 2.35,4.95; GND4 2.35,-4.95 | hole 1: 0,2.2; 0,-2.2
SOT-23-5 = smd 1.2 x 0.55: 1 1.3,-0.95; 2 1.3,0; 3 1.3,0.95; 4 -1.3,0.95; 5 -1.3,-0.95

## Placement (x,y rotation side)
1.2V_CPU  TESTPADTESTPAD_40-ROUND  [TESTPAD_40-ROUND]  54.23,51.05 0 bottom
1.2V_INT  TESTPADTESTPAD_40-ROUND  [TESTPAD_40-ROUND]  49.28,41.02 0 bottom
1.5V  TESTPADTESTPAD_40-ROUND  [TESTPAD_40-ROUND]  46.74,47.88 0 bottom
2.5V  TESTPADTESTPAD_40-ROUND  [TESTPAD_40-ROUND]  23.24,36.32 0 bottom
3.0VA  TESTPADTESTPAD_40-ROUND  [TESTPAD_40-ROUND]  20.07,49.78 0 bottom
3.3V  TESTPADTESTPAD_40-ROUND  [TESTPAD_40-ROUND]  50.04,47.88 0 bottom
5V_E  Open  [SJ_1_SMALLER]  69.34,52.83 270 bottom
5V_E_SATA  [SJ_1_SMALLER]  7.49,57.53 0 bottom
5V_SATA_PWR  CON2DW02R  [DW02R]  4.44,54.99 270 top
5VEXT  TESTPADTESTPAD_40-ROUND  [TESTPAD_40-ROUND]  66.22,41.66 0 bottom
+5V  TESTPADTESTPAD_40-ROUND  [TESTPAD_40-ROUND]  13.33,35.56 0 bottom
BAT  TESTPADTESTPAD_40-ROUND  [TESTPAD_40-ROUND]  70.61,42.16 0 bottom
C1  220nF  [C0402_TI]  64.52,22.73 90 top
C2  220nF  [C0402_TI]  57.15,22.73 90 top
C3  220nF  [C0402_TI]  44.73,24.05 180 bottom
C4  220nF  [C0402_TI]  44.63,25.04 180 bottom
C5  220nF  [C0402_TI]  44.73,27.79 180 bottom
C6  220nF  [C0402_TI]  44.73,28.68 180 bottom
C7  220nF  [C0402_TI]  46.04,25.91 270 bottom
C8  220nF  [C0402_TI]  44.73,31.57 180 bottom
C9  220nF  [C0402_TI]  46.61,30.67 90 bottom
C10  220nF  [C0402_TI]  59.25,38.1 0 bottom
C11  220nF  [C0402_TI]  44.32,33.1 90 bottom
C12  220nF  [C0402_TI]  45.26,33.1 90 bottom
C13  220nF  [C0402_TI]  56.26,22.73 90 top
C14  220nF  [C0402_TI]  65.41,22.73 90 top
C15  22uF/6.3V  [C0603_DWS]  47.12,41.02 180 bottom
C16  220nF  [C0402_TI]  44.73,29.57 0 bottom
C17  220nF  [C0402_TI]  44.73,30.56 0 bottom
C18  220nF  [C0402_TI]  39.55,29.29 270 bottom
C19  220nF  [C0402_TI]  53.78,36.83 180 bottom
C20  220nF  [C0402_TI]  63.5,34.04 0 top
C21  220nF  [C0402_TI]  58.8,31.62 90 bottom
C22  220nF  [C0402_TI]  61.09,29.46 90 bottom
C23  220nF  [C0402_TI]  63.5,25.65 0 top
C24  220nF  [C0402_TI]  61.09,33.53 90 bottom
C25  220nF  [C0402_TI]  51.44,26.16 270 top
C26  220nF  [C0402_TI]  63.5,31.75 0 top
C27  220nF  [C0402_TI]  63.5,26.8 180 top
C28  220nF  [C0402_TI]  38.48,23.5 90 bottom
C29  220nF  [C0402_TI]  37.8,27.94 0 bottom
C30  220nF  [C0402_TI]  37.46,31.5 180 bottom
C31  220nF  [C0402_TI]  39.55,27.36 270 bottom
C32  220nF  [C0402_TI]  35.13,24.87 180 bottom
C33  220nF  [C0402_TI]  44.63,26.9 0 bottom
C34  220nF  [C0402_TI]  42.06,27.94 180 bottom
C35  220nF  [C0402_TI]  42.44,33.1 270 bottom
C36  220nF  [C0402_TI]  41.5,33.1 270 bottom
C37  220nF  [C0402_TI]  43.38,33.1 270 bottom
C38  220nF  [C0402_TI]  61.09,31.5 270 bottom
C39  220nF  [C0402_TI]  63.5,36.32 0 top
C40  220nF  [C0402_TI]  61.09,35.5 270 bottom
C41  220nF  [C0402_TI]  63.5,35.18 180 top
C42  220nF  [C0402_TI]  63.5,27.94 0 top
C43  220nF  [C0402_TI]  63.5,32.89 180 top
C44  220nF  [C0402_TI]  61.47,26.92 90 bottom
C45  220nF  [C0402_TI]  59.56,38.73 180 top
C46  220nF  [C0402_TI]  63.5,30.61 180 top
C47  1nF  [C0402_TI]  26.8,48.51 180 bottom
C48  220nF  [C0402_TI]  41.25,23.5 90 bottom
C49  220nF  [C0402_TI]  54.74,50.04 0 bottom
C50  220nF  [C0402_TI]  40.28,23.5 90 bottom
C51  220nF  [C0402_TI]  37.52,23.5 90 bottom
C52  220nF  [C0402_TI]  39.38,23.5 90 bottom
C53  220nF  [C0402_TI]  39.55,25.43 270 bottom
C54  100nF  [C0402_TI]  56.26,19.68 270 top
C55  22uF/6.3V  [C0603_DWS]  54.99,19.05 270 top
C56  220nF  [C0402_TI]  40.56,33.1 90 bottom
C57  220nF  [C0402_TI]  37.72,33.1 90 bottom
C58  220nF  [C0402_TI]  39.62,33.15 90 bottom
C59  NA  [C0603_DWS]  53.47,22.35 90 top
C60  100nF  [C0402_TI]  63.44,13.08 270 bottom
C61  100nF  [C0402_TI]  55.5,12.06 270 bottom
C62  22uF/6.3V  [C0603_DWS]  64.64,13.46 270 bottom
C63  33pF  [C0603_DWS]  52.2,16 180 bottom
C64  33pF  [C0603_DWS]  52.2,8.38 180 bottom
C65  220nF  [C0402_TI]  35.13,31.32 0 bottom
C66  220nF  [C0402_TI]  39.93,35.08 0 bottom
C67  220nF  [C0402_TI]  35.13,27.69 180 bottom
C68  220nF  [C0402_TI]  39.37,16.13 90 bottom
C69  220nF  [C0402_TI]  39.55,31.22 90 bottom
C70  220nF  [C0402_TI]  44.73,22.99 0 bottom
C71  220nF  [C0402_TI]  43.18,23.5 90 bottom
C72  220nF  [C0402_TI]  42.21,23.5 90 bottom
C73  220nF  [C0402_TI]  36.55,23.5 90 bottom
C74  100nF  [C0402_TI]  60.07,9.91 90 bottom
C75  100nF  [C0402_TI]  55.5,10.03 270 bottom
C76  22uF/6.3V  [C0603_DWS]  56.77,10.54 270 bottom
C77  220nF  [C0402_TI]  35.13,23.95 0 bottom
C78  220nF  [C0402_TI]  35.13,22.99 0 bottom
C79  1uF  [C0603_DWS]  37.66,14.54 180 top
C80  100nF  [C0402_TI]  37.02,15.75 180 top
C81  10pF  [C0603_DWS]  53.15,24.89 270 bottom
C82  100nF  [C0402_TI]  19.3,41.4 180 top
C83  100nF  [C0402_TI]  21.59,41.4 0 top
C84  100nF  [C0402_TI]  21.59,18.29 0 top
C85  10pF  [C0603_DWS]  53.15,21.59 90 bottom
C86  100nF  [C0402_TI]  57.59,14.86 270 bottom
C87  100nF  [C0402_TI]  56.64,18.41 270 bottom
C88  100nF  [C0402_TI]  61.72,18.41 270 bottom
C89  100nF  [C0402_TI]  60.07,12.7 90 bottom
C90  33pF  [C0603_DWS]  26.42,27.56 90 bottom
C91  33pF  [C0603_DWS]  26.42,30.86 270 bottom
C92  22uF/6.3V  [C0603_DWS]  52.58,19.94 180 top
C93  100nF  [C0402_TI]  44.63,25.93 0 bottom
C94  22uF/6.3V  [C0603_DWS]  31.62,41.53 180 top
C95  220nF  [C0402_TI]  35.28,30.43 180 bottom
C96  22uF/6.3V  [C0603_DWS]  16.38,7.75 0 bottom
C97  22uF/6.3V  [C0603_DWS]  26.42,34.16 90 bottom
C98  22uF/6.3V  [C0603_DWS]  16.38,9.27 0 bottom
C99  1uF  [C0603_DWS]  26.67,44.7 180 bottom
C100  220nF  [C0402_TI]  26.16,42.55 180 bottom
C101  10uF/6.3V  [C0603_DWS]  26.67,41.4 0 top
C102  10uF/6.3V  [C0603_DWS]  26.67,44.58 0 top
C103  220nF  [C0402_TI]  26.16,43.43 180 bottom
C104  220nF  [C0402_TI]  22.1,22.73 270 bottom
C105  220nF  [C0402_TI]  21.21,22.73 270 bottom
C106  220nF  [C0402_TI]  32.51,40.32 180 top
C107  220nF  [C0402_TI]  35.05,40.32 0 top
C108  10uF/6.3V  [C0603_DWS]  35.56,39.5 270 bottom
C109  100nF  [C0402_TI]  25.65,13.21 270 bottom
C110  100nF  [C0402_TI]  18.92,15.75 90 bottom
C111  100nF  [C0402_TI]  18.92,11.56 270 bottom
C112  22uF/6.3V  [C0603_DWS]  25.15,15.88 0 bottom
C113  1nF  [C0402_TI]  56.49,58.39 270 bottom
C114  1nF  [C0402_TI]  56.52,54.61 90 bottom
C115  1nF  [C0402_TI]  57.76,58.39 270 bottom
C116  1nF  [C0402_TI]  57.78,54.61 90 bottom
C117  10uF/6.3V  [C0603_DWS]  78.36,20.19 0 bottom
C118  22uF/6.3V  [C0603_DWS]  78.36,23.24 180 bottom
C119  22uF/6.3V  [C0603_DWS]  19.94,22.35 270 bottom
C120  100nF  [C0402_TI]  77.47,26.16 270 bottom
C121  220nF  [C0402_TI]  35.13,26.8 180 bottom
C122  22uF/6.3V  [C0603_DWS]  50.67,42.67 90 top
C123  220nF  [C0402_TI]  35.13,25.83 180 bottom
C124  10uF/6.3V  [C0603_DWS]  78.36,28.83 0 bottom
C125  22uF/6.3V  [C0603_DWS]  78.36,31.88 180 bottom
C126  100nF  [C0402_TI]  77.47,34.29 270 bottom
C127  10nF  [C0402_TI]  8.64,40.13 0 bottom
C128  10nF  [C0402_TI]  8.64,41.02 0 bottom
C129  10nF  [C0402_TI]  8.64,43.94 0 bottom
C130  10uF/6.3V  [C0603_DWS]  71.88,39.5 0 bottom
C131  10nF  [C0402_TI]  8.64,44.83 0 bottom
C132  10uF/6.3V  [C0603_DWS]  66.55,38.23 90 bottom
C133  1uF  [C0603_DWS]  72.9,46.23 0 bottom
C134  10uF/6.3V  [C0603_DWS]  75.31,41.66 270 top
C135  10uF/6.3V  [C0603_DWS]  72.9,47.75 180 bottom
C136  10uF/6.3V  [C0603_DWS]  69.98,48.13 90 bottom
C137  220nF  [C0402_TI]  38.66,33.1 90 bottom
C138  10uF/6.3V  [C0603_DWS]  65.02,38.23 90 bottom
C139  22uF/6.3V  [C0603_DWS]  43.81,41.02 0 bottom
C140  22uF/6.3V  [C0603_DWS]  7.49,54.99 90 bottom
C141  NA(22uF/6.3V)  [C0603_DWS]  5.97,54.99 90 bottom
C142  10uF/6.3V  [C0603_DWS]  53.09,50.55 90 top
C143  1nF  [C0402_TI]  54.36,50.93 90 top
C144  10uF/6.3V  [C0603_DWS]  66.93,51.69 0 top
C145  1uF  [C0603_DWS]  59.18,41.53 90 bottom
C146  10uF/6.3V  [C0603_DWS]  53.47,44.45 90 top
C147  1nF  [C0402_TI]  52.2,44.45 90 top
C148  22uF/6.3V  [C0402_TI]  7.81,51.69 90 bottom
C149  10uF/6.3V  [C0603_DWS]  60.2,49.02 90 bottom
C150  1uF  [C0603_DWS]  61.98,38.23 90 bottom
C151  22uF/6.3V  [C0603_DWS]  24,34.16 90 bottom
C152  220nF  [C0402_TI]  35.13,29.54 180 bottom
C153  10uF/6.3V  [C0603_DWS]  63.5,38.23 270 bottom
C154  1uF  [C0603_DWS]  60.07,40.51 0 top
C155  22uF/6.3V  [C0603_DWS]  49.15,42.67 90 top
C156  220nF  [C0402_TI]  35.13,28.58 180 bottom
C157  10uF/6.3V  [C0603_DWS]  60.71,41.53 90 bottom
C158  10uF/6.3V  [C0603_DWS]  58.67,49.02 90 bottom
C159  10uF/6.3V  [C0603_DWS]  71.88,42.55 0 top
C160  10uF/6.3V  [C0603_DWS]  71.88,41.02 0 top
C161  1nF  [C0402_TI]  69.98,48.64 270 top
C162  220nF  [C0402_TI]  34.9,33.1 270 bottom
C163  10uF/6.3V  [C0603_DWS]  56.52,49.02 90 bottom
C164  22uF/6.3V  [C0603_DWS]  22.48,34.16 90 bottom
C165  22uF/6.3V  [C0603_DWS]  19.43,50.55 0 top
C166  22uF/6.3V  [C0603_DWS]  19.68,43.69 180 top
C167  100nF  [C0402_TI]  20.07,44.96 180 top
C168  220nF  [C0402_TI]  36.78,33.1 270 bottom
C169  22uF/6.3V  [C0603_DWS]  35.18,44.58 0 top
C170  220nF  [C0402_TI]  35.84,33.1 270 bottom
C171  470nF  [C0603_DWS]  35.18,43.05 0 top
C172  22uF/6.3V  [C0603_DWS]  31.62,43.05 180 top
C173  470nF  [C0603_DWS]  35.18,41.53 0 top
C174  470uF/10V/105C  [E2,5-6,3]  69.09,56.13 90 top
C175  22pF  [C0603_DWS]  46.74,45.72 270 bottom
C176  22uF/6.3V  [C0603_DWS]  54.36,41.4 90 bottom
C177  22uF/6.3V  [C0603_DWS]  51.82,45.72 270 bottom
C178  22uF/6.3V  [C0603_DWS]  53.34,45.72 270 bottom
C179  22uF/6.3V  [C0603_DWS]  77.72,42.55 180 bottom
C180  22uF/6.3V  [C0603_DWS]  80.14,43.43 270 bottom
C181  22uF/6.3V  [C0603_DWS]  77.47,48.39 180 bottom
C182  22uF/6.3V  [C0603_DWS]  31.75,52.96 90 bottom
C183  22pF  [C0603_DWS]  25.78,57.78 270 top
C184  22uF/6.3V  [C0603_DWS]  27.3,57.78 270 bottom
C185  22uF/6.3V  [C0603_DWS]  25.78,57.78 270 bottom
C186  22uF/6.3V  [C0603_DWS]  77.72,41.02 180 bottom
C187  NA(47uF/6.3V/tant)  [CT3528_MIL]  71.25,22.35 270 bottom
C188  NA(47uF/6.3V/tant)  [CT3528_MIL]  71.25,32 270 bottom
C189  NA(220uF/6.3V/tant)  [CT6032]  22.61,12.32 90 top
C190  NA(220uF/6.3V/tant)  [CT6032]  6.99,55.63 90 top
C191  NA(22uF/6.3V)  [C0603_DWS]  73.66,23.5 270 bottom
C192  NA(22uF/6.3V)  [C0603_DWS]  73.66,33.15 270 bottom
C193  NA(22uF/6.3V)  [C0603_DWS]  78.36,21.72 180 bottom
C194  NA(22uF/6.3V)  [C0603_DWS]  78.36,30.35 180 bottom
CHGLED  LED/YELLOW/0603  [LED-0603]  77.85,41.02 180 top
D1  1N5819(S4SOD-123)  [SOD-123]  53.09,17.91 180 bottom
D2  1N5819(S4SOD-123)  [SOD-123]  68.83,4.19 0 bottom
D3  NA(1N5822/SS34/SMA)  [MLL-41]  77.6,58.29 0 bottom
D4  SMBJ6.0A  [DO214AA]  77.6,52.32 90 bottom
D5  1N5822/SS34/SMA  [MELF-MLL41]  80.39,38.23 180 bottom
FET1  IRLML6402  [SOT23]  10.29,57.28 270 bottom
FET2  IRLML6402  [SOT23]  71.5,51.18 90 top
FET3  IRLML6402  [SOT23]  71.88,57.4 0 bottom
FET4  BSS138(SOT23-3)  [SOT23]  71.88,53.34 270 bottom
FUSE1  FSMD035  [1206]  11.68,33.02 270 bottom
GND  TESTPADTESTPAD_40-ROUND  [TESTPAD_40-ROUND]  17.27,58.67 0 bottom
GND_PIN  TESTPAD3  [TEST_PAD40/70/SQUARE]  26.16,1.27 0 top
GPIO-1  GPH127SMT-02X20(PA-V16X-2X20-LF)  [YA-V36P-2X20-LF]  38.1,50.16 0 top
GPIO-2  GPH127SMT-02X20(PA-V16X-2X20-LF)  [YA-V36P-2X20-LF]  38.1,9.52 0 top
GPIO-3  GPH127SMT-02X20(PA-V16X-2X20-LF)  [YA-V36P-2X20-LF]  45.72,3.17 0 top
GPIO-4  GPH127SMT-02X10(PA-V16X-2X10-LF)  [YA-V36P-2X10-LF]  14.86,53.09 90 top
HDMI  HDMI-MC34931HDMI-SWM-19_B  [HDMI-SWM-19_REV_B]  4.19,25.27 90 top
IPSOUT  TESTPADTESTPAD_40-ROUND  [TESTPAD_40-ROUND]  58.8,45.59 0 bottom
L1  FB0805/600R/2A  [L0805_5MIL_DWS]  53.21,17.14 270 top
L2  FB0805/600R/2A  [L0805_5MIL_DWS]  61.98,14.22 90 bottom
L3  FB0805/600R/2A  [L0805_5MIL_DWS]  58.55,10.67 90 bottom
L4  CL470nH/0805/1.76R/250mA  [L0805_5MIL_DWS]  16.13,5.21 0 bottom
L5  FB0805/600R/2A  [L0805_5MIL_DWS]  21.46,15.75 180 bottom
L6  FB0805/600R/2A  [L0805_5MIL_DWS]  9.4,3.17 270 top
L7  FB0805/600R/2A  [L0805_5MIL_DWS]  78.99,26.03 90 bottom
L8  FB0805/600R/2A  [L0805_5MIL_DWS]  78.99,34.67 90 bottom
L9  FB0805/600R/2A  [L0805_5MIL_DWS]  71.75,27.94 0 bottom
L10  2.2uH/1.5A/DCR<0.1R/CD32  [CD32]  72.39,46.23 270 top
L11  2.2uH/1.5A/DCR<0.1R/CD32  [CD32]  56.77,50.93 270 top
L12  2.2uH/1.5A/DCR<0.1R/CD32  [CD32]  56.26,45.21 270 top
L13  2.2uH/1.5A/DCR<0.1R/CD32  [CD32]  56.13,45.21 90 bottom
L14  2.2uH/1.5A/DCR<0.1R/CD32  [CD32]  81.41,47.37 270 bottom
L15  2.2uH/1.5A/DCR<0.1R/CD32  [CD32]  30.86,57.4 0 bottom
LAN  RJLBC-060TC1_GND_MILLING  [RJLBC-060TC1_MILLING]  76.83,12.06 90 top
LCD_CON  GPH127SMT-02X20(PA-V16X-2X20-LF)  [YA-V36P-2X20-LF]  45.72,56.52 0 top
LED1  LED/GREEN/0603  [LED-0603]  28.96,2.16 90 top
LIPO_BAT  CON2DW02R  [DW02R]  81.53,43.43 90 top
NAND_E  Close  [SJ_1_SMALLER_CLOSE_10MILS]  20.19,35.69 270 bottom
PB9/PH7_GPIO  [SJ_2_SMALL_23_TIED]  38.73,4.83 0 bottom
PB9/PH7_USB  [SJ_2_SMALL_23_TIED]  38.73,6.86 180 bottom
PC3/PB8  [SJ_2_SMALL_23_TIED]  10.29,47.24 180 bottom
PWR  SIDE_WTCM-TR(3X4)  [SW_TAKT3X4]  1.27,54.36 270 bottom
PWR_JACK  YDJ-1136  [PWR_JACK_UNI_MILLING]  74.3,56.64 180 top
PWR_LED  LED/RED/0603  [LED-0603]  80.26,58.17 180 top
Q1  4SB25.000F20E15/5x3.2mm/20ppm/20pF  [HCX-4S]  52.7,12.19 90 bottom
Q2  32768Hz/6pF  [MC-306]  58.29,23.24 180 bottom
Q3  4SB24.000F20E15/5x3.2mm/20ppm/20pF  [HCX-4S]  23.88,29.21 270 bottom
R1  2.2k  [R0603_5MIL_DWS]  30.73,2.16 90 top
R2  2k/1%  [R0603_5MIL_DWS]  63.25,22.35 270 top
R3  2k/1%  [R0603_5MIL_DWS]  58.42,22.35 270 top
R4  NA  [R0603_5MIL_DWS]  60.83,23.24 180 top
R5  2k/1%  [R0603_5MIL_DWS]  66.67,22.35 90 top
R6  2k/1%  [R0603_5MIL_DWS]  54.99,22.35 90 top
R7  2k/1%  [R0603_5MIL_DWS]  47.62,38.73 0 bottom
R8  330R/1%  [R0603_5MIL_DWS]  63.5,29.27 180 top
R9  22R  [R0402_TI]  50.93,34.16 180 top
R10  100k/1%  [R0603_5MIL_DWS]  23.88,49.78 180 bottom
R11  22R  [R0402_TI]  50.93,33.27 180 top
R12  0R_board_mounted  [R0402_TI_0R]  47.62,37.47 0 bottom
R13  0R_board_mounted  [R0402_TI_0R]  47.62,36.58 0 bottom
R14  330R/1%  [R0603_5MIL_DWS]  43.81,39.5 0 bottom
R15  NA(2.2k)  [R0603_5MIL_DWS]  73.66,12.32 270 bottom
R16  NA(2.2k)  [R0603_5MIL_DWS]  72.14,12.32 90 bottom
R17  10k  [R0402_TI]  23.62,41.4 0 top
R18  10k  [R0402_TI]  22.61,42.29 0 top
R19  2k/1%  [R0603_5MIL_DWS]  60.83,21.21 0 top
R20  10k  [R0402_TI]  19.3,42.29 180 top
R21  47k  [R0603_5MIL_DWS]  51.05,20.64 270 bottom
R22  560R  [R0603_5MIL_DWS]  79.76,16.13 270 bottom
R23  47k  [R0603_5MIL_DWS]  37.66,16.95 0 top
R24  NA  [R0603_5MIL_DWS]  58.8,14.73 270 bottom
R25  560R  [R0603_5MIL_DWS]  79.76,6.1 270 bottom
R26  100k/1%  [R0603_5MIL_DWS]  16.38,11.81 180 bottom
R27  10k  [R0402_TI]  16.38,10.54 180 bottom
R28  200k/1%  [R0603_5MIL_DWS]  26.67,42.93 180 top
R29  10k  [R0402_TI]  10.92,13.72 270 top
R30  2k/1%  [R0603_5MIL_DWS]  14.48,32.13 90 top
R31  2k/1%  [R0603_5MIL_DWS]  12.95,32.13 90 top
R32  47k  [R0603_5MIL_DWS]  11.43,32.13 90 top
R33  4.99k/1%  [R0603_5MIL_DWS]  21.46,13.97 180 bottom
R34  NA(0R)  [R0603_5MIL_DWS]  42.61,40.39 90 top
R35  10k  [R0402_TI]  21.08,9.14 0 bottom
R36  13k/1%  [R0603_5MIL_DWS]  24.51,9.91 270 bottom
R37  10k  [R0402_TI]  24.51,13.21 90 bottom
R38  NA  [R0603_5MIL_DWS]  52.45,56.39 0 bottom
R39  NA  [R0603_5MIL_DWS]  52.45,54.86 0 bottom
R40  10k  [R0402_TI]  82.04,20.32 180 bottom
R41  6.81k/1%  [R0603_5MIL_DWS]  81.79,26.16 180 bottom
R42  47k  [R0603_5MIL_DWS]  11.18,3.17 90 top
R43  2.2k  [R0603_5MIL_DWS]  43.69,45.72 270 bottom
R44  2.2k  [R0603_5MIL_DWS]  45.21,45.72 270 bottom
R45  2.2k  [R0603_5MIL_DWS]  52.83,49.02 270 bottom
R46  2.2k  [R0603_5MIL_DWS]  51.31,49.02 270 bottom
R47  10k  [R0402_TI]  82.04,28.45 180 bottom
R48  13k/1%  [R0603_5MIL_DWS]  81.79,34.29 180 bottom
R49  10k  [R0402_TI]  68.83,5.97 180 bottom
R50  100R  [R0603_5MIL_DWS]  71.88,39.5 180 top
R51  0.03R/1%  [R1206_5MIL_WS]  72.64,42.93 90 bottom
R52  10k  [R0402_TI]  10.29,54.48 180 bottom
R53  100k/1%  [R0603_5MIL_DWS]  66.55,31.11 90 bottom
R54  10k  [R0402_TI]  9.78,48.89 180 bottom
R55  200k/1%  [R0603_5MIL_DWS]  66.55,34.42 90 bottom
R56  2.2k  [R0603_5MIL_DWS]  77.85,42.55 180 top
R57  191R/1%  [R0603_5MIL_DWS]  26.67,41.27 180 bottom
R58  4.99k/1%  [R0603_5MIL_DWS]  6.6,51.69 270 bottom
R59  200k/1%  [R0603_5MIL_DWS]  60.07,42.04 0 top
R60  2k  [R0402_TI]  69.09,48.64 270 top
R61  2k  [R0402_TI]  66.93,50.42 180 top
R62  2k  [R0402_TI]  67.18,51.44 90 bottom
R63  2k  [R0402_TI]  62.99,40.13 180 top
R64  2k  [R0402_TI]  68.07,51.44 90 bottom
R65  2.2k  [R0603_5MIL_DWS]  76.96,58.17 0 top
R66  0R(Board_Mounted)  [0603_0R]  66.8,56.77 270 bottom
R67  8.25k/1%  [R0603_5MIL_DWS]  75.31,41.66 270 bottom
R68  4.99k/1%  [R0603_5MIL_DWS]  48.77,45.72 270 bottom
R69  1.1k/1%  [R0603_5MIL_DWS]  75.31,45.97 90 bottom
R70  3.32k/1%  [R0603_5MIL_DWS]  47.88,43.31 0 bottom
R71  4.99k/1%  [R0603_5MIL_DWS]  27.3,57.78 270 top
R72  1.1k/1%  [R0603_5MIL_DWS]  26.92,52.96 90 bottom
R73  10M  [R0402_TI]  51.94,23.24 90 bottom
R74  10k  [R0402_TI]  72.39,50.16 0 bottom
R75  47k  [R0603_5MIL_DWS]  73.15,57.4 270 top
R76  NA  [R0402_TI]  18.61,35.5 90 bottom
R77  1M  [R0402_TI]  74.17,49.02 0 bottom
RECOVERY  SIDE_WTCM-TR(3X4)  [SW_TAKT3X4]  1.27,37.85 270 bottom
RESET  SIDE_WTCM-TR(3X4)  [SW_TAKT3X4]  1.27,46.1 270 bottom
RM1  RA1206_(4X0603)_4B8_4.7k  [R_MATRIX_4]  64.26,18.29 180 bottom
RM2  RA1206_(4X0603)_4B8_4.7k  [R_MATRIX_4]  62.61,10.29 180 bottom
RM3  RA1206_(4X0603)_4B8_51R  [R_MATRIX_4]  59.18,18.29 0 bottom
RM4  RA1206_(4X0603)_4B8_100K  [R_MATRIX_4]  16.38,2.16 270 bottom
RM5  RA1206_(4X0603)_4B8_10k  [R_MATRIX_4]  50.16,2.16 180 bottom
SATA  SATA-PWA-07  [SATA-PWA-07]  3.98,42.91 90 top
SD/MMC1  MICRO_SD/MMC_CP_NEWTFC-WPAPR-08  [TFC-WPAPR-08]  5.46,8.63 0 bottom
T1  BC846B  [SOT23]  10.29,51.69 0 bottom
U1  MEM4G16D3EABG-125  [FBGA96_MEM]  56.82,31.09 270 top
U2  RTL8201CP  [LQFP48]  60.07,14.22 0 top
U3  AT24C16BN-SH  [SO-08MN]  79.12,12.06 270 bottom
U4  H27UBG8T2BTR  [TSOP48]  21.59,29.84 270 top
U5  NA(RCLAMP0524P)  [SLP2510P8]  13.21,22.35 90 top
U6  NA(RCLAMP0524P)  [SLP2510P8]  13.21,25.4 90 top
U7  A20  [TFBGA441]  39.92,28.29 90 top
U8  NA(RCLAMP0524P)  [SLP2510P8]  13.21,28.32 90 top
U9  SY6280  [SOT23-5]  21.46,11.56 180 bottom
U10  SY6280  [SOT23-5]  81.53,23.24 90 bottom
U11  SY6280  [SOT23-5]  81.53,31.37 90 bottom
U12  AXP209(QFN48)  [QFN48]  65.15,44.96 180 top
U13  SY8008C(AA)C  [SOT23-5]  51.82,41.91 90 bottom
U14  SY7208(SOT23-6)  [SOT23-6]  77.72,45.47 270 bottom
U15  SY8008C(AA)C  [SOT23-5]  29.34,52.32 90 bottom
U20  MCP120T475I-TT  [SOT23']  76.71,45.28 270 top
U$2  [HAMMOND_1593LBK_A10_LIME]  0,0 0 top
U$5  [LOGO-OPENHARDWARE_8X8]  21.21,44.32 0 bottom
U$6  [OLIMEX1_V]  29.08,9.02 0 bottom
U$8  [OLIMEX1_V]  82.75,14.63 37 top
U$9  [PB]  39.24,51.82 0 bottom
U$10  [ESD_SYMBOL]  19.05,27.69 0 bottom
U$11  [RECYCLE_BIN1/8]  41.53,42.42 0 bottom
U$12  [ROHS]  17.65,21.72 0 bottom
UART0  HN1X3  [HN1X3]  69.85,1.52 0 top
USB_HOST1  USB_A_VERTICAL  [USB_A_VERTICAL_PTH]  87.88,22.61 90 top
USB_HOST2  USB_A_VERTICAL  [USB_A_VERTICAL_PTH]  87.88,32.26 90 top
USB_OTG  USB-OTG  [USB_MINI_9PIN]  4.06,7.63 0 top
VR1  AP1231-2.5V(SOT23-5)  [SOT-23-5]  19.94,47.62 90 top

## Tracks (layer width: path | path; a pad name or v marks a point on that pad's centre or on a via)
5VEXT  (via drill 0.6)
  Top 0.203: U12.32 65.75,41 65.96,41 66.15,41 U12.33
  Top 0.508: 74.3,54.23 74.3,56.39 R65.1 | U20.2 75.86,44.07 78.74,44.07 79.25,44.58 79.25,46.86 75.95,50.16 74.3,50.16 PWR_JACK.+
  Top 0.61: v66.22,40.26 65.96,40.51 65.96,41
  Top 1.016: C174.+ 69.72,54.23 74.3,54.23 PWR_JACK.+
  Route14 0.813: v66.22,40.26 66.22,41.2
  Route14 1.016: 66.22,41.2 66.22,41.71 68.58,44.07 68.58,46.23 69.85,47.5 73.02,47.5 74.04,48.51 74.04,49.78 74.3,50.04 PWR_JACK.+
  Bottom 0.254: v66.22,40.26 5VEXT.1
  Bottom 0.508: 69.34,53.34 5V_E.1
  Bottom 0.61: v66.22,40.26 66.55,39.93 C132.2 | 74.3,50.42 74.04,50.16 R74.1
  Bottom 0.762: C174.+ 69.34,54.61 69.34,53.34
  Bottom 1.016: D4.C 77.6,50.42 74.3,50.42 PWR_JACK.+ 74.3,57.4 | 74.3,57.4 74.3,57.53 75.06,58.29 D3.A | 74.3,57.4 FET3.3
+5V  (via drill 0.4, 0.6)
  Top 0.61: v33.66,57.15 LCD_CON.1 | v26.04,50.8 GPIO-1.1 | v33.66,3.81 GPIO-3.1 | v26.04,10.16 GPIO-2.1
  Top 0.889: v69.72,51.31 69.72,51.45 FET2.2
  Top 1.016: 13.33,33.02 R30.2 | 13.33,33.02 v13.33,34.42 v11.68,36.07 v11.68,37.08 | 13.33,33.02 R31.2 | R75.1 70.87,58.29 70.23,58.93 v69.6,58.93
  Route14 0.508: v18.54,12.83 18.92,12.83 v19.18,13.08
  Route14 1.016: v80.26,20.57 79.25,21.59 79.25,27.94 v80.26,28.96 80.26,29.78 83.06,32.58 83.06,54.1 v82.17,54.99 80.01,54.99 79.63,54.61 75.44,54.61 75.06,54.99 73.41,54.99 72.77,54.36 70.61,54.36 | v33.66,3.81 30.48,3.81 25.53,8.76 25.53,10.16 | 25.53,10.16 v26.04,10.16 | 25.53,10.16 25.4,10.29 21.46,10.29 18.92,12.83 18.16,13.59 18.16,17.14 13.33,21.97 v13.33,34.42 v11.68,36.07 v11.68,37.08 | v69.72,51.31 70.61,52.2 70.61,54.36 | v69.6,58.93 70.23,58.93 70.61,58.55 70.61,54.36
  Route15 1.016: v11.68,36.07 v11.68,37.08 9.91,38.86 6.86,38.86 5.33,40.39 5.33,44.58 7.62,46.86 8.76,46.86 | 26.04,52.07 27.94,52.07 33.02,57.15 v33.66,57.15 33.66,57.78 34.54,58.67 57.28,58.67 58.17,57.78 58.17,51.94 59.56,50.55 63.75,50.55 64.13,50.93 64.64,50.93 65.02,51.31 v69.72,51.31 | 26.04,52.07 v26.04,50.8 | 26.04,52.07 24.89,52.07 22.22,49.4 19.81,49.4 16.64,46.23 13.33,46.23 12.7,46.86 8.76,46.86 | 8.76,46.86 v8.76,57.53
  Bottom 0.254: 11.68,35.56 +5V.1
  Bottom 0.508: U11.5 80.58,29.28 v80.26,28.96 | v80.26,20.57 80.58,20.89 U10.5 | 8,57.53 5V_E_SATA.1 | U9.5 20,12.51 19.56,12.06 C111.1 18.92,12.83 | 18.92,12.83 v18.54,12.83 | 18.92,12.83 v19.18,13.08 | 69.34,52.32 5V_E.2
  Bottom 0.61: 9.4,54.48 R52.1
  Bottom 0.762: 8,57.53 v8.76,57.53 9.34,56.96 FET1.2 9.4,56.12 9.4,54.48 | v69.72,51.31 69.34,51.69 69.34,52.32
  Bottom 1.016: v80.26,20.57 79.88,20.19 C117.1 | v80.26,28.96 80.14,28.83 C124.1 | v82.17,54.99 82.17,56.26 80.14,58.29 D3.K | FET3.2 70.21,58.93 v69.6,58.93
  Bottom 1.524: FUSE1.1 11.68,35.56 v11.68,36.07 v11.68,37.08
+5V_OTG_PWR  (via drill 0.4, 0.6)
  Top 0.203: U12.31 65.35,41.3 65.1,41.05
  Top 0.508: v65.1,40.41 v65.1,41.02 65.1,41.05 | USB_OTG.VBUS 9.82,9.23 v10.03,9.02
  Top 0.762: v65.79,29.46 65.53,29.72 65.53,38.86 65.1,39.29 v65.1,40.41
  Route14 1.016: v10.03,9.02 23.5,9.02 31.62,0.89 56.52,0.89 58.17,2.54 v58.17,3.17 | v65.79,29.46 66.55,28.7 66.55,22.1 v71.63,17.02
  Route15 0.61: v65.1,40.41 v65.1,41.02
  Route15 0.813: v65.1,40.41 65.1,39.8 65.53,39.37 65.53,29.72 v65.79,29.46
  Route15 0.889: 60.33,9.52 60.39,9.59 64.45,9.59 64.52,9.52
  Route15 1.016: v58.17,3.17 58.17,7.37 60.33,9.52 | 64.52,9.52 67.82,6.22 70.74,6.22 71.63,7.11 v71.63,17.02
  Bottom 0.508: L5.1 19.94,15.24 C110.1
  Bottom 0.61: v65.1,40.41 v65.1,41.02 | C110.1 16.64,12.95 12.83,12.95 10.03,10.16 v10.03,9.02
  Bottom 0.762: v65.79,29.46 R53.1
  Bottom 0.813: v65.1,40.41 65.1,39.19 C138.2
+24V  (via drill 0.4, 0.6)
  Top 0.203: U12.38 68.91,43.16 68.91,43.36 68.91,43.56 U12.39 | v70.1,44.45 69.85,44.45 69.54,44.76 U12.42
  Top 0.61: 68.91,43.36 v69.16,43.1 v69.16,42.49
  Route3 1.016: v72.52,48.89 72.52,48.01 77.72,42.8 81.17,42.8 LIPO_BAT.1
  Route15 0.508: v69.16,42.49 69.16,43.13
  Bottom 0.254: BAT.1 69.49,42.16 v69.16,42.49
  Bottom 0.813: v69.16,42.49 v69.16,43.1 69.16,43.51 v70.1,44.45 70.48,44.83 72.01,44.83
  Bottom 1.016: R51.2 72.2,44.83 72.01,44.83 C133.2 C135.1 72.01,48.13 72.52,48.64 v72.52,48.89 | LIPO_BAT.1 80.25,42.43 C180.2
BA0  (via drill 0.25)
  Top 0.127: v54.02,27.89 U1.M2 | U7.K3 v47.52,26.29
  Bottom 0.127: v54.02,27.89 54.02,27.96 53.66,28.32 52.7,28.32 50.93,26.54 50.8,26.54 50.67,26.67 50.67,27.3 50.55,27.43 50.42,27.43 50.29,27.3 50.29,25.91 50.16,25.78 50.04,25.78 49.91,25.91 49.91,26.61 49.78,26.73 49.66,26.73 49.53,26.61 49.53,25.91 49.4,25.78 49.28,25.78 49.15,25.91 49.15,26.61 49.02,26.73 48.89,26.73 48.77,26.61 48.77,25.91 48.64,25.78 48.51,25.78 48.39,25.91 48.39,26.61 48.26,26.73 48.13,26.73 48.01,26.61 48.01,25.91 47.88,25.78 47.62,25.78 47.52,25.89 v47.52,26.29
BA1  (via drill 0.25)
  Top 0.127: v58.82,27.09 U1.N8 | U7.L4 v46.72,27.09
  Route3 0.127: v58.82,27.09 58.42,26.69 50.78,26.69 50.67,26.8 50.67,27.18 50.55,27.3 50.42,27.3 50.29,27.18 50.29,26.64 50.19,26.53 50.03,26.53 49.91,26.65 49.91,27.18 49.78,27.3 49.66,27.3 49.53,27.18 49.53,26.64 49.4,26.51 49.28,26.51 49.15,26.64 49.15,27.18 49.02,27.3 48.89,27.3 48.77,27.18 48.77,26.64 48.64,26.51 48.51,26.51 48.39,26.64 48.39,27.18 48.26,27.3 48.13,27.3 48.01,27.18 48.01,26.81 47.89,26.69 47.12,26.69 v46.72,27.09
BA2  (via drill 0.25)
  Top 0.127: v54.82,27.89 U1.M3 | v46.72,26.29 U7.K4
  Bottom 0.127: v54.82,27.89 54.42,27.49 52.26,27.49 51.44,26.67 51.44,25.02 51.31,24.89 51.18,24.89 51.05,25.02 51.05,25.98 50.93,26.11 50.8,26.11 50.67,25.98 50.67,25.02 50.55,24.89 50.42,24.89 50.29,25.02 50.29,25.4 50.16,25.53 50.04,25.53 49.91,25.4 49.91,25.02 49.78,24.89 49.66,24.89 49.53,25.02 49.53,25.4 49.4,25.53 49.28,25.53 49.15,25.4 49.15,25.02 49.02,24.89 48.12,24.89 v46.72,26.29
CASN  (via drill 0.25)
  Top 0.127: v54.82,30.29 U1.K3 | U7.U3 v47.52,32.69
  Bottom 0.127: v47.52,32.69 47.95,32.69 49.53,31.11 49.8,31.11 50.16,30.75 50.16,29.97 50.29,29.84 50.42,29.84 50.55,29.97 50.55,30.86 50.67,30.99 50.8,30.99 50.93,30.86 50.93,29.97 51.05,29.84 51.18,29.84 51.31,29.97 51.31,30.86 51.44,30.99 51.56,30.99 51.69,30.86 51.69,29.97 51.82,29.84 51.94,29.84 52.07,29.97 52.07,30.73 52.2,30.86 52.32,30.86 52.45,30.73 52.45,29.97 52.58,29.84 54.61,29.84 54.82,30.05 v54.82,30.29
CKE  (via drill 0.25, 0.25 pad 0.46)
  Top 0.127: v58.82,29.49 59.62,29.49 U1.K9 | U7.N3 v47.52,28.69
  Bottom 0.127: v58.82,29.49 58.47,29.84 57.78,29.84 57.02,29.08 49.78,29.08 49.66,28.96 49.66,27.94 49.53,27.81 49.4,27.81 49.28,27.94 49.28,28.96 49.15,29.08 47.91,29.08 v47.52,28.69
CLK  (via drill 0.25)
  Top 0.127: v56.9,32.51 57.4,32 57.4,30.4 57.53,30.28 58.23,30.28 58.42,30.47 U1.J7 | R9.1 51.56,34.04 v52.07,34.04
  Bottom 0.127: v56.9,32.51 56.77,32.38 56.39,32.38 56.26,32.51 56.26,34.42 56.01,34.67 55.5,34.67 55.24,34.42 55.24,32.89 55.12,32.77 52.7,32.77 52.58,32.89 52.58,33.53 v52.07,34.04
CLKN  (via drill 0.25)
  Top 0.127: v56.9,31.88 57.15,31.62 57.15,30.23 57.35,30.02 58.29,30.02 U1.K7 | R11.1 51.56,33.4 v52.07,33.4
  Bottom 0.127: v56.9,31.88 56.64,32.13 56.26,32.13 56.01,32.38 56.01,34.29 55.88,34.42 55.63,34.42 55.5,34.29 55.5,32.77 55.24,32.51 52.58,32.51 52.32,32.77 52.32,33.27 52.2,33.4 v52.07,33.4
CPU-REF  (via drill 0.25, 0.4)
  Top 0.127: v47.52,24.69 U7.H3 | v45.92,35.09 U7.Y5 | U7.H4 v46.72,24.69 | v43.52,35.89 U7.AA8
  Top 0.203: v49.72,24.32 49.91,24.51 51.18,24.51 52.07,23.62 53.09,23.62 C59.2
  Top 0.508: R3.1 R4.2
  Top 0.61: R3.1 C2.2 C13.2 R6.2 C59.2
  Route14 0.127: 46.32,25.99 46.32,34.69 v45.92,35.09 45.52,35.49 43.92,35.49 v43.52,35.89
  Route14 0.152: 46.32,25.99 46.72,25.59 v46.72,24.69 v47.52,24.69
  Bottom 0.203: v46.72,24.69 v47.52,24.69 47.7,24.51 49.53,24.51 v49.72,24.32
DDR3_ODT  (via drill 0.25)
  Top 0.127: U1.K1 53.29,29.89 52.7,30.48 52.7,32 v52.64,32.07
  Bottom 0.127: v52.64,32.07 52.58,32.13 50.29,32.13 49.53,32.89 49.53,35.69 49.4,35.81 49.28,35.81 49.15,35.69 49.15,34.23 49.02,34.1 48.89,34.1 48.77,34.23 48.77,35.94 R13.1
DDR3_RST  (via drill 0.25)
  Top 0.127: v56.26,27.69 56.13,27.56 56.13,26.22 55.4,25.49 54.82,25.49 U1.T2
  Route14 0.127: v50.48,32.58 50.48,31.94 53.34,29.08 55.44,29.08 56.26,28.26 v56.26,27.69
  Bottom 0.127: v50.48,32.58 49.78,33.27 49.78,35.81 R12.1 48.13,38.35 R7.1
DDR_VREF  (via drill 0.25 pad 0.46, 0.4)
  Top 0.127: v53.22,31.09 U1.H1 | v55.75,31.24 57.02,29.97 57.02,29.72 58.05,28.69 58.82,28.69 U1.M8 59.62,27.89 60.56,27.89 v60.71,27.75
  Top 0.508: v60.71,27.75 61.09,27.37 61.09,24.19 61.72,23.56 R4.1
  Top 0.61: R4.1 R2.1 C1.2 C14.2 R5.2
  Bottom 0.127: v53.22,31.09 U1.H1 55.5,31.49 v55.75,31.24
  Bottom 0.305: v60.71,27.75 60.45,27.75 60.01,28.19 60.01,30.1 59.63,30.48 57.47,30.48 56.71,31.24 v55.75,31.24
DQ0
  Top 0.127: U1.E3 55.63,34.3 55.63,35.94 56.13,36.45 56.13,37.21 55.18,38.16 54.42,38.16 52.7,39.88 49.02,39.88 47.5,38.35 47.37,38.35 47.24,38.48 47.24,38.73 47.12,38.86 46.99,38.86 46.86,38.73 46.86,38.19 46.74,38.06 46.61,38.06 46.48,38.19 46.48,39.13 46.35,39.26 46.23,39.26 46.1,39.13 46.1,37.97 46.72,37.35 46.72,36.69 U7.AB4
DQ1
  Top 0.127: U1.F7 58.42,33.15 57.53,34.04 57.53,36.58 55.44,38.67 54.67,38.67 52.96,40.39 46.48,40.39 43.92,37.83 U7.AC7
DQ2
  Top 0.127: U7.AC4 46.16,37.09 45.85,37.4 45.85,39.37 46.61,40.13 46.74,40.13 46.86,40 46.86,39.69 46.99,39.56 47.12,39.56 47.24,39.69 47.24,40 47.37,40.13 52.83,40.13 54.55,38.42 55.31,38.42 56.39,37.34 56.39,36.32 55.88,35.81 55.88,33.95 55.42,33.49 54.82,33.49 U1.F2
DQ3  (via drill 0.25, 0.25 pad 0.46)
  Top 0.127: v59.62,32.69 U1.F8 | U7.AB8 v43.52,36.69
  Route3 0.127: v43.52,36.69 43.92,36.29 46.2,36.29 46.48,36.58 47.5,36.58 48.39,35.69 49.28,35.69 49.4,35.56 49.4,35.18 49.53,35.06 49.66,35.06 49.78,35.18 49.78,35.56 49.91,35.69 51.18,35.69 52.97,33.89 56.66,33.89 56.9,33.66 58.04,33.66 58.6,33.09 U1.F8 v59.62,32.69
DQ4  (via drill 0.25)
  Top 0.127: U7.AC8 v43.52,37.49 | v54.82,31.89 U1.H3
  Route3 0.127: v43.52,37.49 U7.AC8 43.12,35.69 43.32,35.49 47.82,35.49 47.94,35.37 48.7,35.37 50.93,33.15 51.05,33.15 51.18,33.27 51.18,34.64 51.31,34.77 51.44,34.77 51.56,34.64 51.56,32.51 52.58,31.49 54.42,31.49 v54.82,31.89
DQ5  (via drill 0.25, 0.25 pad 0.46)
  Top 0.127: v57.09,34.1 57.98,33.21 57.98,32.18 58.26,31.89 58.82,31.89 U1.H8 | U7.AB5 v45.92,36.69
  Route3 0.127: v45.92,36.69 46.25,37.02 48.26,37.02 48.39,36.89 48.39,36.13 48.51,36 48.64,36 48.77,36.13 48.77,36.89 48.89,37.02 49.02,37.02 49.15,36.89 49.15,36.13 49.28,36 49.4,36 49.53,36.13 49.53,36.7 49.66,36.83 50.55,36.83 52.68,34.69 55.48,34.69 55.88,34.29 56.9,34.29 v57.09,34.1
DQ6  (via drill 0.25)
  Top 0.127: v54.02,31.89 U1.G2 | U7.AB7 v44.32,36.69
  Route14 0.127: v44.32,36.69 44.72,36.29 47.78,36.29 50.23,33.84 50.67,33.84 50.8,33.97 50.8,34.54 50.93,34.67 51.05,34.67 51.18,34.54 51.18,33.91 51.31,33.78 51.44,33.78 51.56,33.91 51.56,34.54 51.71,34.69 55.02,34.69 55.24,34.47 55.24,33.12 v54.02,31.89
DQ7  (via drill 0.25)
  Top 0.127: v57.53,33.02 57.53,32.25 58.29,31.49 U1.H7 | U7.AC3 47.12,37.59 49.15,39.62 52.58,39.62 54.29,37.91 54.99,37.91 55.69,37.21 v55.69,36.66
  Bottom 0.127: v55.69,36.66 55.69,35.37 56.64,34.42 56.64,33.91 v57.53,33.02
DQ8  (via drill 0.25 pad 0.46)
  Top 0.127: v58.02,35.09 U1.D7 | U7.AB2 48.32,36.69 48.32,37.65 49.15,38.48 50.29,38.48 50.42,38.61 50.42,38.99 50.55,39.12 50.67,39.12 50.8,38.99 50.8,38.61 50.93,38.48 51.05,38.48 51.18,38.61 51.18,38.99 51.31,39.12 51.44,39.12 51.56,38.99 51.56,38.61 51.69,38.48 51.82,38.48 51.94,38.61 51.94,38.99 52.07,39.12 52.32,39.12 52.77,38.67 v52.77,38.16
  Bottom 0.127: v52.77,38.16 53.21,37.72 53.59,37.72 53.97,38.1 56.39,38.1 56.64,37.85 56.64,36.14 57.69,35.09 v58.02,35.09
DQ9  (via drill 0.25, 0.25 pad 0.46)
  Top 0.127: v54.82,35.09 U1.C3 | U7.Y1 48.92,34.69 49.85,35.62 50.93,35.62 51.05,35.75 51.05,36.96 51.18,37.08 51.31,37.08 51.44,36.96 51.44,34.92 51.56,34.8 51.69,34.8 51.82,34.92 51.82,38.1 51.94,38.23 52.07,38.23 52.2,38.1 52.2,35.66 52.43,35.43 v52.58,35.43
  Bottom 0.127: v52.58,35.43 52.83,35.69 52.83,36.19 52.96,36.32 53.09,36.32 53.21,36.19 53.21,35.69 53.41,35.49 54.42,35.49 v54.82,35.09
DQ10  (via drill 0.25 pad 0.46)
  Top 0.127: v59.62,35.09 U1.C8 | U7.AC2 47.92,37.63 49.02,38.73 49.78,38.73 50.42,39.37 52.45,39.37 53.4,38.42 v53.4,38.16
  Bottom 0.127: v53.4,38.16 53.59,38.35 56.52,38.35 56.9,37.97 56.9,36.38 57.79,35.49 58.42,35.49 58.55,35.37 58.55,34.6 58.67,34.47 58.8,34.47 58.93,34.6 58.93,35.05 59.05,35.18 59.53,35.18 v59.62,35.09
DQ11  (via drill 0.25)
  Top 0.127: v54.02,35.89 U1.C2 | v50.61,36.13 50.35,35.88 49.72,35.88 48.94,35.09 48.32,35.09 U7.Y2
  Route14 0.127: v50.61,36.13 50.42,36.32 50.42,37.47 50.55,37.59 50.67,37.59 50.8,37.47 50.8,36.7 50.93,36.58 51.05,36.58 51.18,36.7 51.18,37.47 51.31,37.59 51.44,37.59 51.56,37.47 51.56,35.81 51.69,35.69 51.82,35.69 51.94,35.81 51.94,38.91 52.07,39.04 52.2,39.04 52.32,38.91 52.32,36.26 52.45,36.13 52.9,36.13 53.28,35.75 53.88,35.75 v54.02,35.89
DQ12  (via drill 0.25, 0.25 pad 0.46)
  Top 0.127: v58.82,36.69 U1.A7 | U7.AA1 48.95,35.49 49.78,36.32 v49.97,36.32
  Bottom 0.127: v58.82,36.69 58.68,36.69 57.91,37.47 57.91,38.35 56.9,39.37 51.05,39.37 50.16,38.48 50.16,37.19 50.04,37.07 49.91,37.07 49.78,37.19 49.78,38.02 49.66,38.15 49.53,38.15 49.4,38.02 49.4,36.89 v49.97,36.32
DQ13  (via drill 0.25)
  Top 0.127: v54.02,37.49 U1.A2 | U7.AB3 47.52,36.69 47.52,37.61 49.09,39.18 v49.53,39.18
  Route3 0.127: v54.02,37.49 54.18,37.65 54.29,37.77 54.29,38.26 53.95,38.61 53.34,38.61 53.21,38.73 53.21,39.37 53.09,39.5 52.96,39.5 52.83,39.37 52.83,38.73 52.7,38.61 52.58,38.61 52.45,38.73 52.45,39.62 52.32,39.75 52.2,39.75 52.07,39.62 52.07,38.61 51.94,38.48 51.82,38.48 51.69,38.61 51.69,39.62 51.56,39.75 51.44,39.75 51.31,39.62 51.31,38.61 51.18,38.48 51.05,38.48 50.93,38.61 50.93,39.62 50.8,39.75 50.67,39.75 50.55,39.62 50.55,38.61 50.42,38.48 50.29,38.48 50.16,38.61 50.16,39.62 50.04,39.75 49.91,39.75 49.78,39.62 49.78,39.37 49.59,39.18 v49.53,39.18
DQ14  (via drill 0.25, 0.25 pad 0.46)
  Top 0.127: v59.62,35.89 U1.B8 | U7.W2 48.32,34.29 48.9,34.29 49.97,35.37 50.61,35.37 v50.86,35.11
  Route14 0.127: v59.62,35.89 59.22,35.49 57.55,35.49 57.4,35.63 57.4,36.83 57.28,36.96 57.15,36.96 57.02,36.83 57.02,35.67 56.9,35.54 56.77,35.54 56.64,35.67 56.64,36.83 56.52,36.96 56.39,36.96 56.26,36.83 56.26,35.94 55.81,35.49 53.15,35.49 52.77,35.88 52.39,35.88 51.63,35.11 v50.86,35.11
DQ15  (via drill 0.25)
  Top 0.127: U7.AC1 48.72,37.42 v48.83,37.53 | v54.85,37.47 U1.A3